# EAGLE design design1 (EAGLE 9.5.1)

## Sheet 1 of 3: Rectifier
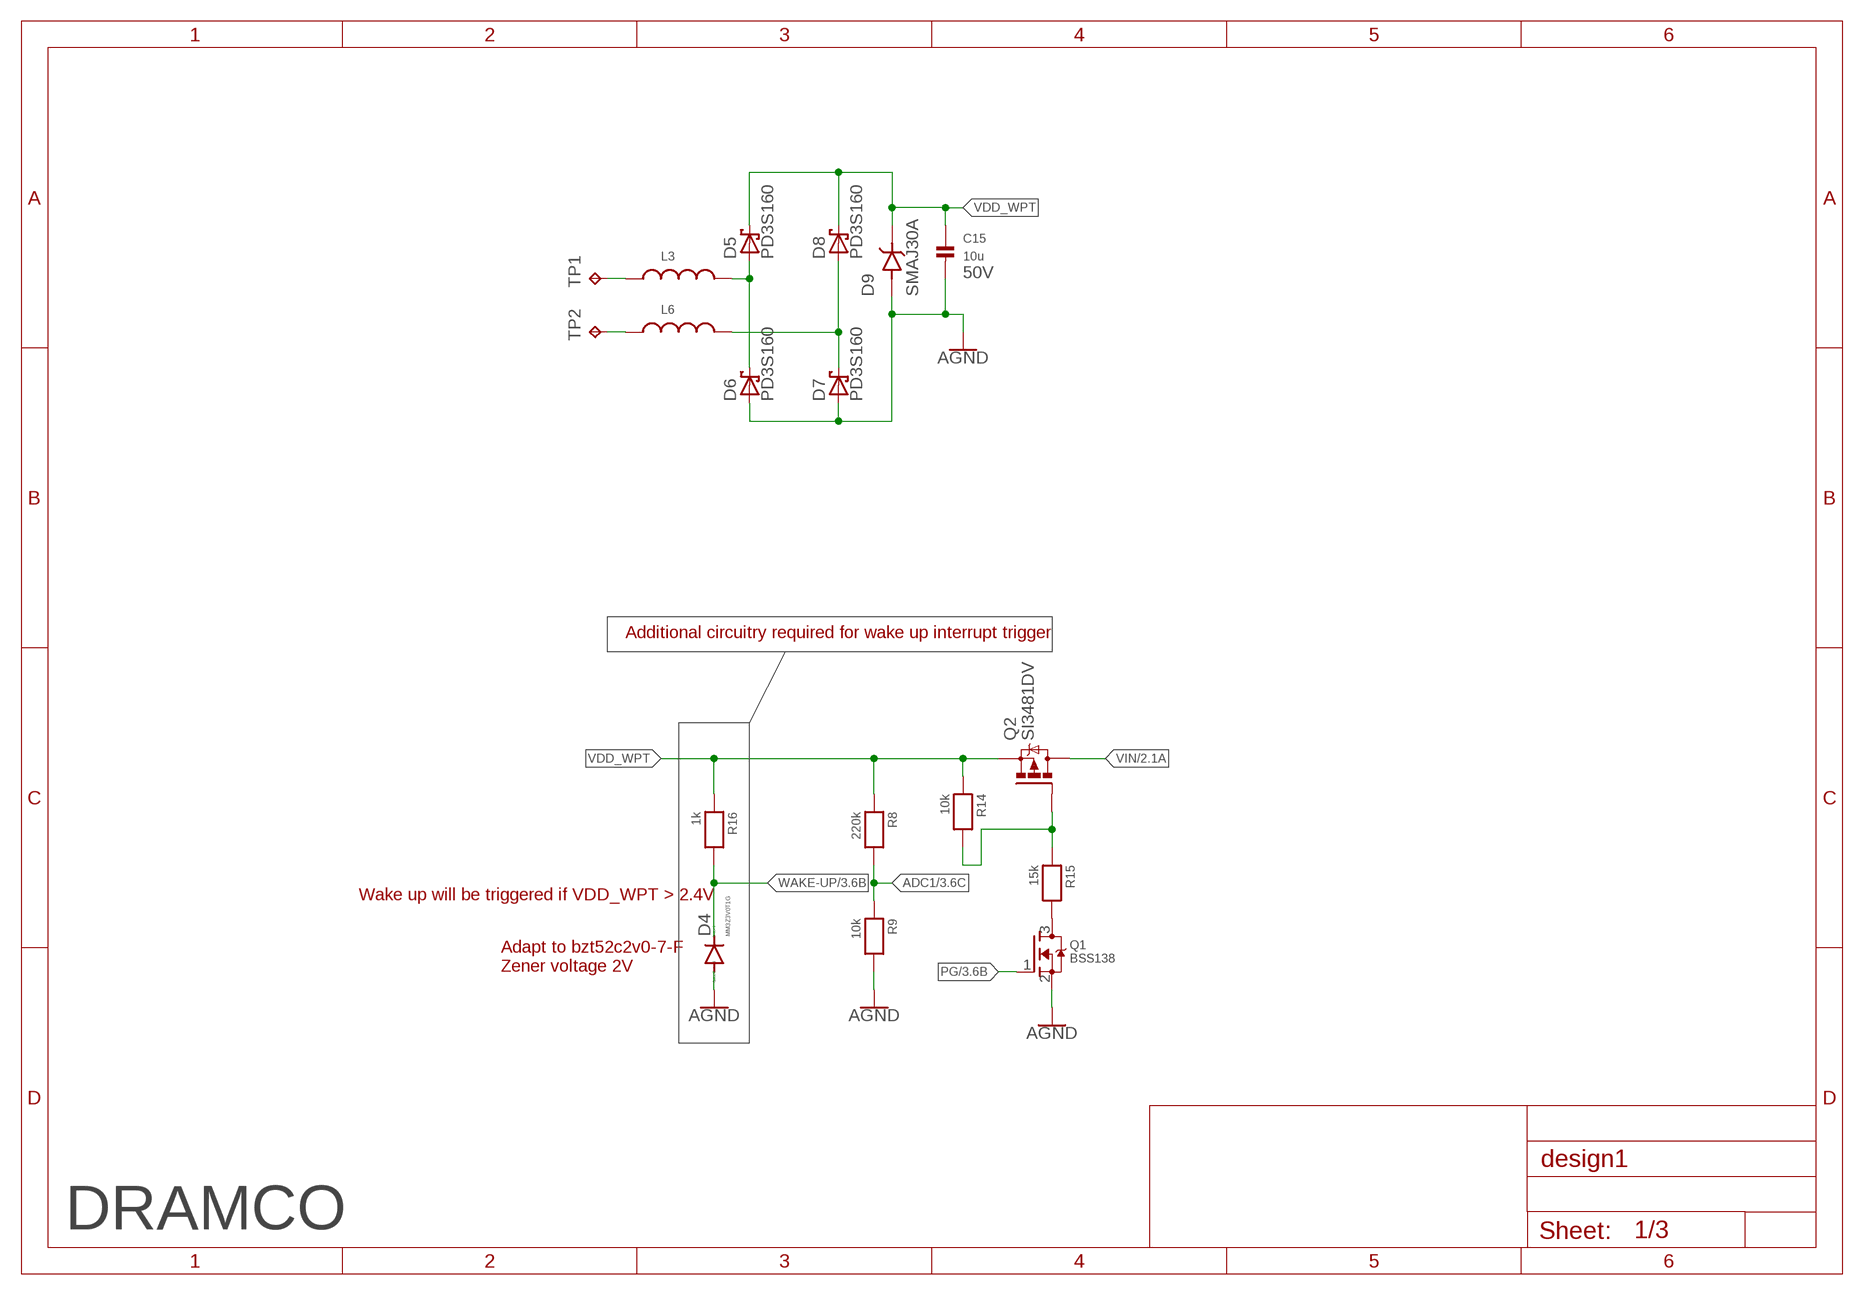
[diagram p0: schematic, sheet 1]

### Parts
C15  10u  CAP_CERAMIC1206  [1206]
D4  MM3Z3V0T1G  DIODE-SOD323-R  [SOD323-R]
D5  PD3S160  [POWERDI323]
D6  PD3S160  [POWERDI323]
D7  PD3S160  [POWERDI323]
D8  PD3S160  [POWERDI323]
D9  SMAJ30A  [DIOM5026X229N]
L3  WE-CAIR_4248_744912182  [WE-CAIR_4248]
L6  WE-CAIR_4248_744912182  [WE-CAIR_4248]
Q1  BSS138  MOSFET-NREFLOW  [SOT23-R]
Q2  SI3481DV  [TSOP-6.PAC]
R8  220k  RESISTOR0603  [0603]
R9  10k  RESISTOR0603  [0603]
R14  10k  RESISTOR0603  [0603]
R15  15k  RESISTOR0603  [0603]
R16  1k  RESISTOR0603  [0603]
TP1  TPTP20SQ  [TP20SQ]
TP2  TPTP20SQ  [TP20SQ]

### Nets
ADC1: R8.2 R9.1 ; also sheet 3
AGND: C15.2 D4.A D6.A D7.A D9.A Q1.2(S) R9.2 ; also sheet 2,3
N$4: Q1.3(D) R15.2
N$5: Q2.3(G) R14.2 R15.1
N$12: L6.1 TP2.TP
N$14: L3.1 TP1.TP
N$15: D5.A D6.C L3.2
N$16: D7.C D8.A L6.2
PG: Q1.1(G) ; also sheet 3
VDD_WPT: C15.1 D5.C D8.C D9.C Q2.4(S) R8.1 R14.1 R16.1
VIN: Q2.1(D) Q2.2(D) Q2.5(D) Q2.6(D) ; also sheet 2
WAKE-UP: D4.C R16.2 ; also sheet 3

### Notes on the sheet
- 50V
- Additional circuitry required for wake up interrupt trigger
- Wake up will be triggered if VDD_WPT > 2.4V
- Adapt to bzt52c2v0-7-F
  Zener voltage 2V
- DRAMCO

## Sheet 2 of 3: Step-down converter
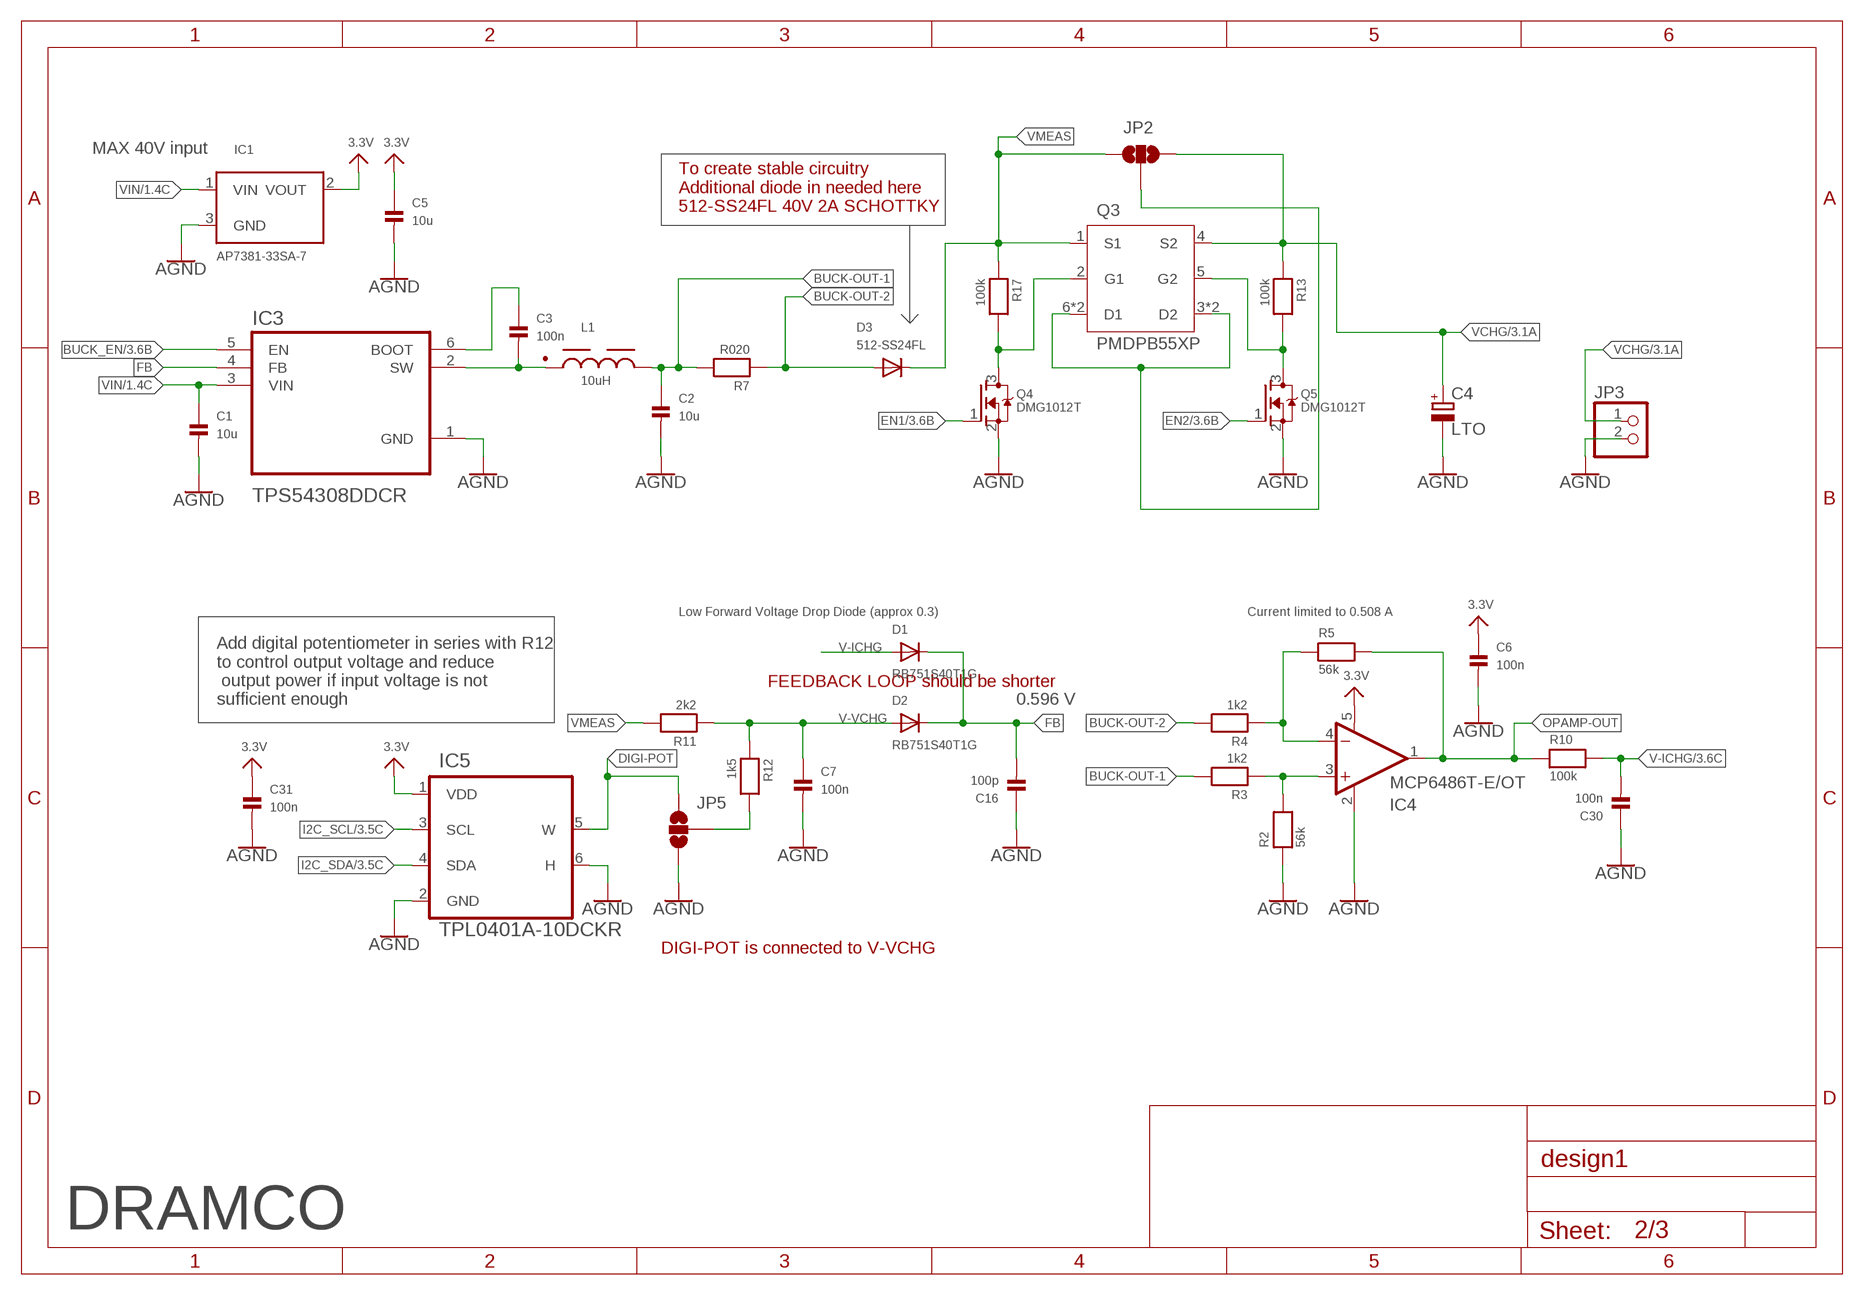
[diagram p1: schematic, sheet 2]

### Parts
C1  10u  CAP_CERAMIC0603  [0603]
C2  10u  CAP_CERAMIC0603  [0603]
C3  100n  CAP_CERAMIC0603  [0603]
C4  LTO  CPOL-EUE5-10.5  [E5-10,5]
C5  10u  CAP_CERAMIC0603  [0603]
C6  100n  CAP_CERAMIC0402  [0402]
C7  100n  CAP_CERAMIC0603  [0603]
C16  100p  CAP_CERAMIC0603  [0603]
C30  100n  CAP_CERAMIC0603  [0603]
C31  100n  CAP_CERAMIC0402  [0402]
D1  RB751S40T1G  DIODESOD-523  [SOD-523]
D2  RB751S40T1G  DIODESOD-523  [SOD-523]
D3  512-SS24FL  DIODESOD-123  [SOD-123]
IC1  AP7381-33SA-7  VREG_SOT23  [SOT23-R]
IC3  TPS54308DDCR  [SOT95P280X110-6N]
IC4  MCP6486T-E/OT  MCP6291T-E/OT  [SOT23-5]
IC5  TPL0401A-10DCKR  [SOT65P210X110-6N]
JP2  JUMPER-SMT_3_NO_NO-SILK  [SMT-JUMPER_3_NO_NO-SILK]
JP3  HEADER-1X2ROUND  [1X02_ROUND]
JP5  JUMPER-SMT_3_NO_NO-SILK  [SMT-JUMPER_3_NO_NO-SILK]
L1  10uH  WE-PD_7332_PLASTIC_7447789127  [WE-PD_7332/7345_PLASTIC_BASE]
Q3  PMDPB55XP  [SON65P200X200X65-8N]
Q4  DMG1012T  [SOT523-3]
Q5  DMG1012T  [SOT523-3]
R2  56k  RESISTOR0603  [0603]
R3  1k2  RESISTOR0603  [0603]
R4  1k2  RESISTOR0603  [0603]
R5  56k  RESISTOR0603  [0603]
R7  R020  RESISTOR0603  [0603]
R10  100k  RESISTOR0603  [0603]
R11  2k2  RESISTOR0603  [0603]
R12  1k5  RESISTOR0603  [0603]
R13  100k  RESISTOR0402  [0402]
R17  100k  RESISTOR0402  [0402]

### Nets
3.3V: C5.1 C6.1 C31.1 IC1.2(VOUT) IC4.5(V+) IC5.1(VDD)
AGND: C1.2 C2.2 C4.- C5.2 C6.2 C7.2 C16.1 C30.1 C31.2 IC1.3(GND) IC3.1(GND) IC4.2(V-) IC5.2(GND) IC5.6(H) JP3.2 JP5.1 Q4.2(S) Q5.2(S) R2.1 ; also sheet 1,3
BUCK-OUT-1: C2.1 L1.2 R3.2 R7.2
BUCK-OUT-2: D3.A R4.2 R7.1
BUCK_EN: IC3.5(EN) ; also sheet 3
DIGI-POT: IC5.5(W) JP5.3
EN1: Q4.1(G) ; also sheet 3
EN2: Q5.1(G) ; also sheet 3
FB: C16.2 D1.K(C) D2.K(C) IC3.4(FB)
I2C_SCL: IC5.3(SCL) ; also sheet 3
I2C_SDA: IC5.4(SDA) ; also sheet 3
N$1: JP2.2 Q3.3(D2) Q3.6(D1) Q3.7(D1) Q3.8(D2)
N$2: C3.1 IC3.6(BOOT)
N$3: C3.2 IC3.2(SW) L1.1
N$6: JP5.2 R12.2
N$8: IC4.4(-IN) R4.1 R5.1
N$9: IC4.3(+IN) R2.2 R3.1
N$17: Q3.2(G1) Q4.3(D) R17.2
N$18: Q3.5(G2) Q5.3(D) R13.2
OPAMP-OUT: IC4.1(OUT) R5.2 R10.1
V-ICHG: C30.2 D1.A R10.2 ; also sheet 3
V-VCHG: C7.1 D2.A R11.1 R12.1
VCHG: C4.+ JP2.3 JP3.1 Q3.4(S2) R13.1 ; also sheet 3
VIN: C1.1 IC1.1(VIN) IC3.3(VIN) ; also sheet 1
VMEAS: D3.C JP2.1 Q3.1(S1) R11.2 R17.1

### Notes on the sheet
- MAX 40V input
- To create stable circuitry
  Additional diode in needed here
  512-SS24FL 40V 2A SCHOTTKY
- Low Forward Voltage Drop Diode (approx 0.3) | Current limited to 0.508 A
- FEEDBACK LOOP should be shorter
- Add digital potentiometer in series with R12 
  to control output voltage and reduce
   output power if input voltage is not 
  sufficient enough
- 0.596 V
- DIGI-POT is connected to V-VCHG
- DRAMCO

## Sheet 3 of 3: MCU
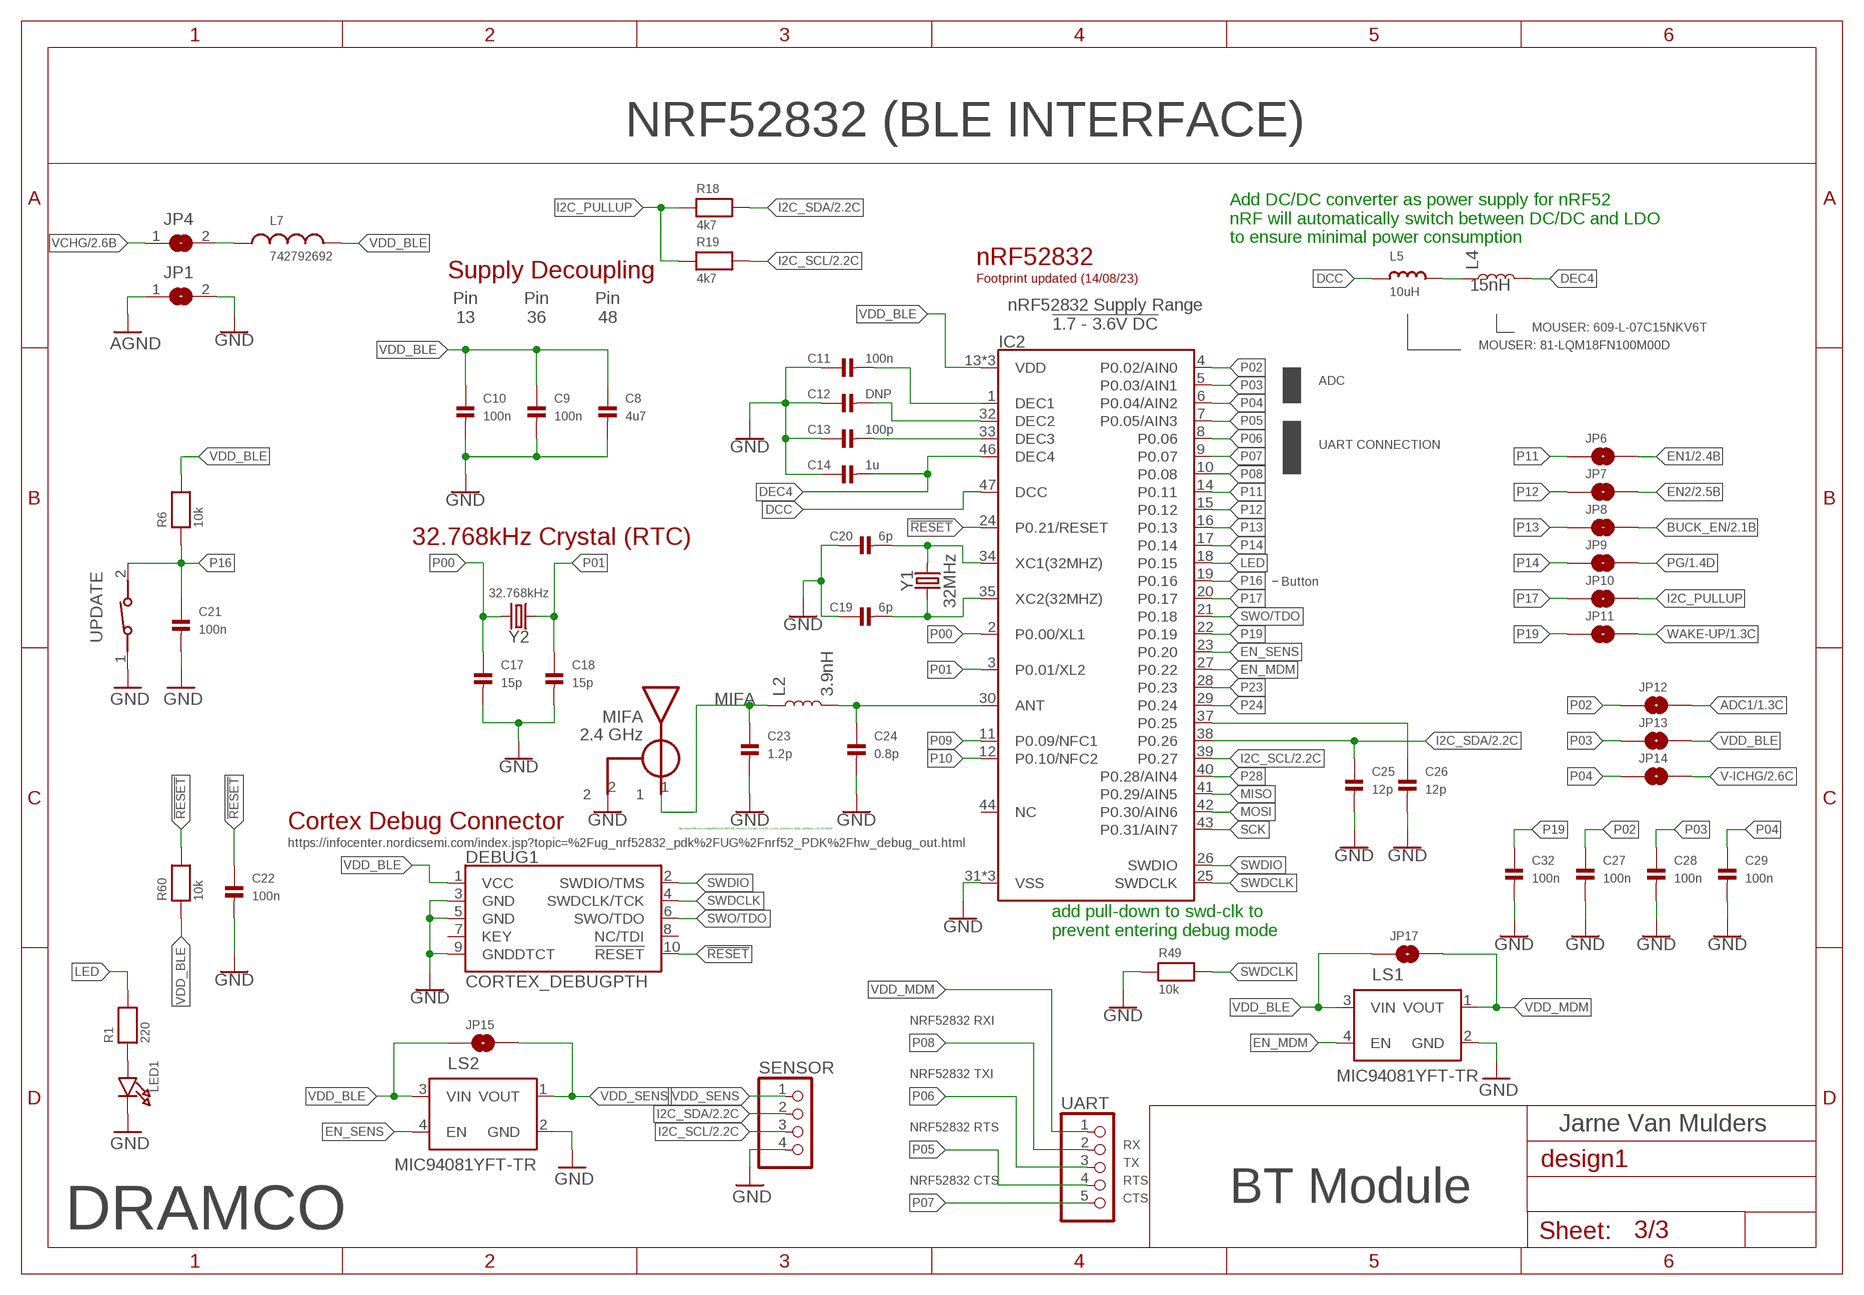
[diagram p2: schematic, sheet 3]

### Parts
C8  4u7  CAP_CERAMIC0603  [0603]
C9  100n  CAP_CERAMIC0402  [0402]
C10  100n  CAP_CERAMIC0402  [0402]
C11  100n  CAP_CERAMIC0402  [0402]
C12  DNP  CAP_CERAMIC0402  [0402]
C13  100p  CAP_CERAMIC0402  [0402]
C14  1u  CAP_CERAMIC0402  [0402]
C17  15p  CAP_CERAMIC0402  [0402]
C18  15p  CAP_CERAMIC0402  [0402]
C19  6p  CAP_CERAMIC0402  [0402]
C20  6p  CAP_CERAMIC0402  [0402]
C21  100n  CAP_CERAMIC0402  [0402]
C22  100n  CAP_CERAMIC0402  [0402]
C23  1.2p  CAP_CERAMIC0402  [0402]
C24  0.8p  CAP_CERAMIC0402  [0402]
C25  12p  CAP_CERAMIC0402  [0402]
C26  12p  CAP_CERAMIC0402  [0402]
C27  100n  CAP_CERAMIC0402  [0402]
C28  100n  CAP_CERAMIC0402  [0402]
C29  100n  CAP_CERAMIC0402  [0402]
C32  100n  CAP_CERAMIC0402  [0402]
DEBUG1  CORTEX_DEBUGPTH  [2X5-PTH-1.27MM]
IC2  NRF52832-EXTENDED  [QFN48-6X6MM-EXTENDED]
JP1  SOLDERJUMPERREFLOW_NOPASTE  [SOLDERJUMPER_REFLOW_NOPASTE]
JP4  SOLDERJUMPERREFLOW_NOPASTE  [SOLDERJUMPER_REFLOW_NOPASTE]
JP6  JUMPER-SMT_2_NO_NO-SILK  [SMT-JUMPER_2_NO_NO-SILK]
JP7  JUMPER-SMT_2_NO_NO-SILK  [SMT-JUMPER_2_NO_NO-SILK]
JP8  JUMPER-SMT_2_NO_NO-SILK  [SMT-JUMPER_2_NO_NO-SILK]
JP9  JUMPER-SMT_2_NO_NO-SILK  [SMT-JUMPER_2_NO_NO-SILK]
JP10  JUMPER-SMT_2_NO_NO-SILK  [SMT-JUMPER_2_NO_NO-SILK]
JP11  JUMPER-SMT_2_NO_NO-SILK  [SMT-JUMPER_2_NO_NO-SILK]
JP12  JUMPER-SMT_2_NO_NO-SILK  [SMT-JUMPER_2_NO_NO-SILK]
JP13  JUMPER-SMT_2_NO_NO-SILK  [SMT-JUMPER_2_NO_NO-SILK]
JP14  JUMPER-SMT_2_NO_NO-SILK  [SMT-JUMPER_2_NO_NO-SILK]
JP15  JUMPER-SMT_2_NO_NO-SILK  [SMT-JUMPER_2_NO_NO-SILK]
JP17  JUMPER-SMT_2_NO_NO-SILK  [SMT-JUMPER_2_NO_NO-SILK]
L2  3.9nH  INDUCTOR-0402-3.9NH  [0402]
L4  15nH  INDUCTOR-0402-3.9NH  [0402]
L5  10uH  INDUCTOR_0603MP  [_0603MP]
L7  742792692  WE-CBF_0603_742792692_WB_HS  [WE-CBF_0603(W=2.2)]
LED1  LED0805  [CHIPLED_0805]
LS1  MIC94081YFT-TR  [IC_MIC94081YFT-TR]
LS2  MIC94081YFT-TR  [IC_MIC94081YFT-TR]
R1  220  RESISTOR0603  [0603]
R6  10k  RESISTOR0402  [0402]
R18  4k7  RESISTOR0402  [0402]
R19  4k7  RESISTOR0402  [0402]
R49  10k  RESISTOR0402  [0402]
R60  10k  RESISTOR0402  [0402]
SENSOR  HEADER-1X4ROUND  [1X04_ROUND]
U$18  BLE-ANT  [ANT-2G4]
UART  HEADER-1X5ROUND  [1X05_ROUND]
UPDATE  434111043826  [434111043826]
Y1  32MHz  CRYSTAL-32MHZ-SMD-2.0X1.6MM  [CRYSTAL-SMD-2.0X1.6MM]
Y2  32.768kHz  CRYSTAL-32.768KHZSMD-3.2X1.5  [CRYSTAL-SMD-3.2X1.5MM]

### Nets
!RESET!: C22.1 DEBUG1.10(!RESET) IC2.24(P0.21/RESET) R60.2
ADC1: JP12.2 ; also sheet 1
AGND: JP1.1 ; also sheet 1,2
ANT: C24.1 IC2.30(ANT) L2.2
BUCK_EN: JP8.2 ; also sheet 2
DCC: IC2.47(DCC) L5.1
DEC4: C14.2 IC2.46(DEC4) L4.2
DEC5: C11.2 IC2.1(DEC1)
DEC6: C12.2 IC2.32(DEC2)
DEC8: C13.2 IC2.33(DEC3)
EN1: JP6.2 ; also sheet 2
EN2: JP7.2 ; also sheet 2
EN_MDM: IC2.27(P0.22) LS1.4(EN)
EN_SENS: IC2.23(P0.20) LS2.4(EN)
GND: C8.2 C9.2 C10.2 C11.1 C12.1 C13.1 C14.1 C17.2 C18.2 C19.1 C20.1 C21.2 C22.2 C23.2 C24.2 C25.2 C26.2 C27.2 C28.2 C29.2 C32.2 DEBUG1.3(GND) DEBUG1.5(GND) DEBUG1.9(GNDDTCT) IC2.31(VSS) IC2.45(VSS) IC2.EP(VSS) JP1.2 LED1.C LS1.2(GND) LS2.2(GND) R49.1 SENSOR.4 U$18.2 UPDATE.1
I2C_PULLUP: JP10.2 R18.1 R19.1
I2C_SCL: IC2.39(P0.27) R19.2 SENSOR.3 ; also sheet 2
I2C_SDA: C25.1 IC2.38(P0.26) R18.2 SENSOR.2 ; also sheet 2
LED: IC2.18(P0.15) R1.2
MIFA: C23.1 L2.1 U$18.1
MISO: IC2.41(P0.29/AIN5)
MOSI: IC2.42(P0.30/AIN6)
N$7: JP4.2 L7.1
N$20: LED1.A R1.1
N$50: C26.1 IC2.37(P0.25)
N$53: L4.1 L5.2
P00: C17.1 IC2.2(P0.00/XL1) Y2.P$2
P01: C18.1 IC2.3(P0.01/XL2) Y2.P$1
P02: C27.1 IC2.4(P0.02/AIN0) JP12.1
P03: C28.1 IC2.5(P0.03/AIN1) JP13.1
P04: C29.1 IC2.6(P0.04/AIN2) JP14.1
P05: IC2.7(P0.05/AIN3) UART.4
P06: IC2.8(P0.06) UART.3
P07: IC2.9(P0.07) UART.5
P08: IC2.10(P0.08) UART.2
P09: IC2.11(P0.09/NFC1)
P10: IC2.12(P0.10/NFC2)
P11: IC2.14(P0.11) JP6.1
P12: IC2.15(P0.12) JP7.1
P13: IC2.16(P0.13) JP8.1
P14: IC2.17(P0.14) JP9.1
P16: C21.1 IC2.19(P0.16) R6.1 UPDATE.2
P17: IC2.20(P0.17) JP10.1
P19: C32.1 IC2.22(P0.19) JP11.1
P23: IC2.28(P0.23)
P24: IC2.29(P0.24)
P28: IC2.40(P0.28/AIN4)
PG: JP9.2 ; also sheet 1
SCK: IC2.43(P0.31/AIN7)
SWDCLK: DEBUG1.4(SWDCLK/TCK) IC2.25(SWDCLK) R49.2
SWDIO: DEBUG1.2(SWDIO/TMS) IC2.26(SWDIO)
SWO/TDO: DEBUG1.6(SWO/TDO) IC2.21(P0.18)
V-ICHG: JP14.2 ; also sheet 2
VCHG: JP4.1 ; also sheet 2
VDD_BLE: C8.1 C9.1 C10.1 DEBUG1.1(VCC) IC2.13(VDD) IC2.36(VDD) IC2.48(VDD) JP13.2 JP15.1 JP17.1 L7.2 LS1.3(VIN) LS2.3(VIN) R6.2 R60.1
VDD_MDM: JP17.2 LS1.1(VOUT) UART.1
VDD_SENS: JP15.2 LS2.1(VOUT) SENSOR.1
WAKE-UP: JP11.2 ; also sheet 1
XC1: C20.2 IC2.34(XC1(32MHZ)) Y1.3
XC2: C19.2 IC2.35(XC2(32MHZ)) Y1.1
Unconnected: DEBUG1.7(KEY) DEBUG1.8(NC/TDI) IC2.44(NC)

### Notes on the sheet
- NRF52832 (BLE INTERFACE)
- Add DC/DC converter as power supply for nRF52
  nRF will automatically switch between DC/DC and LDO
  to ensure minimal power consumption
- nRF52832
- Supply Decoupling
- Footprint updated (14/08/23)
- nRF52832 Supply Range
  !1.7 - 3.6V DC!
- Pin
  13
- Pin
  36
- Pin
  48
- MOUSER: 609-L-07C15NKV6T
- MOUSER: 81-LQM18FN100M00D
- ADC
- UART CONNECTION
- 32.768kHz Crystal (RTC)
- Button
- Cortex Debug Connector | https://www.infineon.com/dgdl/Infineon-AN91445_Antenna_Design_and_RF_Layout_Guidelines-ApplicationNotes-v09_00-EN.pdf
- https://infocenter.nordicsemi.com/index.jsp?topic=%2Fug_nrf52832_pdk%2FUG%2Fnrf52_PDK%2Fhw_debug_out.html
- add pull-down to swd-clk to 
  prevent entering debug mode
- NRF52832 RXI
- NRF52832 TXI
- NRF52832 RTS | Jarne Van Mulders
- RX
- TX
- NRF52832 CTS | RTS
- CTS | BT Module
- DRAMCO

## Library data of the parts
C1-C3 C5-C32 = microbuilder:CAP_CERAMIC: Ceramic Capacitors 0402 - 0402 Surface Mount Capacitors 16pF 50V 5% [Digikey: 445-4899-2-ND] 18pF 50V 5% [Digikey: 490-1281-2-ND] 22pF 50V 5% [Digikey: 490-1283-2-ND] 68pF 50V 5% [Digikey: 490-1289-2-ND] 0.1uF 10V 10% [Digikey: 490-1318-2-ND] 1.0uF 6.3V 10% [Digikey: 490-1320-2-ND] 0603 - 0603 Surface Mount Capacitors 16 pF 50V 5% [Digikey: 445-5051-2-ND] 22 pF 50V [Digikey: PCC220ACVTR-ND] 33 pF 50V 5% [Digikey: 490-1415-1-ND] 56pF 50V 5% [Digikey: 490-1421-1-ND] 220pF 50V 5% [Digikey: 445-1285-1-ND] 680 pF 50V 2200 pF 50V 5% C0G [Digikey: 445-1297-1-ND] 5600 pF 100V 5% X7R [Digikey: 478-3711-1-ND] 0.1 µF 25V 10% [Digikey: PCC2277TR-ND] 0.22 µF 16V 10% X7R [Digikey: 445-1318-1-ND] 1.0 µF 25V 10% [Digikey: 445-5146-2-ND] 0603 - RF Specific 3pF 250V +/-0.1pF RF [Digikey: 712-1347-1-ND] 18 pF 250V 5% [Digikey: 478-3505-1-ND or 712-1322-1-ND] 56 pF 250V 5% C0G RF [Digikey: 490-4867-1-ND] 68 pF 250V RF [Digikey: 490-4868-1-ND] 0805 - 0805 Surface Mount Capacitors 220 pF 250V 2% RF Ceramic Capacitor [Digikey: 712-1398-1-ND] 1000 pF 50V 2% NP0 Ceramic Capacitor [Digikey: 478-3760-1-ND] 0.1 µF 25V 10% Ceramic Capacitor [Digikey: PCC1828TR-ND] 1.0 µF 16V 10% Ceramic Capacitor[Digikey: 490-1691-2-ND] 10.0 µF 10V 10% Ceramic Capacitor[Digikey: 709-1228-1-ND] 10.0 uF 16V 10% Ceramic Capacitor [Digikey: 478-5165-2-ND] 47 uF 6.3V 20% Ceramic Capacitor [Digikey: 587-1779-1-ND or 399-5506-1-ND] 1206 - 1206 Surface Mount Capacitors 47uF 10V 20% Ceramic Capacitor [Digikey: 490-5528-1-ND or 399-5508-1-ND or 445-6010-1-ND] 100uF 6.3V -20%, +80% Y5V Ceramic Capacitor (Digikey: 490-4512-1-ND, Mouser: 81-GRM31CF50J107ZE1L)
C4 = rcl:CPOL-EU: POLARIZED CAPACITOR, European symbol
D1-D3 = microbuilder:DIODE: Diode SMA Model Volts Amps Type Vf Vr Digikey # Notes SSA34-E3 40V 3A Schottky 480mV @ 3A 200uA @ 40V SSA34-E3/61TGITR-ND CDBA120-G 20V 1A Schottky 500mV @ 1A 500uA @ 20V 641-1014-6-ND REEL MBRA210 10V 2A Schottky 350mV @ 2A 700uA @ 10V MBRA210LT3 SOD-123 Model Volts Amps Type Vf Vr Order # Notes BAT54T1G 30V 200mA Schottky 800mV @ 200mA 2uA @ 25V BAT54T1GOSTR-ND B0530W 30V 500mA Schottky 430mV @ 500mA 130uA @ 30V B0530W-FDICT-ND REEL MBR120 1A 20V Schottky 340mV @ 1A MBR120VLSFT1GOSCT-ND SOD-323 Model Volts Amps Type Vf Vr Order # Notes PMEG2005EJ 20V 500mA Schottky 355mV @ 500mA 568-4110-1-ND ZLLS410 10V 570mA Schottky 380mV @ 570mA ZLLS410CT-ND 1N4148WS 75V 150mA Silicon/Simple 1V 1N4148WSFSCT-ND REEL SOD-523 Model Volts Amps Type Vf Vr Order # Notes BAT54XV2 30V 200mA Schottky 0.8V @ 100mA BAT54XV2CT-ND TB751S 30V 30mA Schottky RB751S-40TE61CT-ND SOT23-R/W (R = Solder Paste/Reflow Ovens, W = Hand-Soldering) Model Volts Amps Type Vf Vr Order # Notes BAT54FILM 40V 300mA Schottky 497-7162-1-ND
D4 = diode:DIODE-: DIODE
D5-D8 = diode:PD3S160: 1.0A SURFACE MOUNT SCHOTTKY BARRIER RECTIFIER POWERDI ® 323 Source: http://www.diodes.com/datasheets/ds30899.pdf
D9 = SMAJ30A:SMAJ30A: SMAJ Series 48.4 V 0.4 kW Surface Mount Uni-Directional TVS Diode - DO-214AC Check prices <https://pricing.snapeda.com/parts/SMAJ30A/Littelfuse/view-part?ref=eda>; AVAILABILITY: Good; DESCRIPTION: 48.4V Clamp 8.3A Ipp Tvs Diode Surface Mount DO-214AC (SMA); MF: Littelfuse; MP: SMAJ30A; PACKAGE: DO-214 Littelfuse; PRICE: None; PURCHASE-URL: https://pricing.snapeda.com/search/part/SMAJ30A/?ref=eda
DEBUG1 = SparkFun-Connectors:CORTEX_DEBUG: Cortex Debug Connector Datasheet <http://infocenter.arm.com/help/topic/com.arm.doc.faqs/attached/13634/cortex_debug_connectors.pdf>
IC1 = microbuilder:VREG_SOT23: SOT23 Fixed Voltage Regulators Part Current Out V Out V In V Dropout Digikey Part No. AP7313 150mA 3.3V 3.5-6V 0.15V @ 150mA AP7313-33SAG-7DICT-ND
IC2 = SparkFun-RF:NRF52832-EXTENDED
IC3 = TPS54308DDCR:TPS54308DDCR: Check availability <https://pricing.snapeda.com/parts/TPS54308DDCR/Texas%20Instruments/view-part?ref=eda>; AVAILABILITY: In Stock; DESCRIPTION: 4.5-V to 28-V Input, 3-A output, synchronous 350-kHz FCCM step-down converter; MF: Texas Instruments; MP: TPS54308DDCR; PACKAGE: SOT-23-THN-6 Texas Instruments; PRICE: None; PURCHASE-URL: https://pricing.snapeda.com/search/part/TPS54308DDCR/?ref=eda
IC4 = SparkFun-Retired:MCP6291: Rail to rail OpAmp with 10MHz GBP Prototype: IC-11991; PROD_ID: IC-11991; VALUE: MCP6291T
IC5 = TPL0401A-10DCKR:TPL0401A-10DCKR: Check availability <https://pricing.snapeda.com/parts/TPL0401A-10DCKR/Texas%20Instruments/view-part?ref=eda>; AVAILABILITY: In Stock; CHECK_PRICES: https://www.snapeda.com/parts/TPL0401A-10DCKR/Texas+Instruments/view-part/?ref=eda; DESCRIPTION: 128-tap single-channel digital potentiometer (digipot) with I2C interface (address 0101110); MF: Texas Instruments; MP: TPL0401A-10DCKR; PACKAGE: SOT-SC70-6 Texas Instruments; PRICE: None; PURCHASE-URL: https://pricing.snapeda.com/search?q=TPL0401A-10DCKR&ref=eda; SNAPEDA_LINK: https://www.snapeda.com/parts/TPL0401A-10DCKR/Texas+Instruments/view-part/?ref=snap
JP1 JP4 = microbuilder:SOLDERJUMPER: SMD Solder JUMPER Solder the two pads together to create a connection, or remove the solder to break it. REFLOW - Use this footprint for solder paste and reflow ovens. WAVE - Use this footprint for hand-soldering (larger pads). CLOSED - Has a trace between the two pads to ensure it is closed by default. The trace needs to be cut to disable the jumper, and can be closed again by creating a solder bridge between the two pads.
JP2 JP5 = SparkFun-Jumpers:JUMPER-SMT_3_NO: Normally open jumper This jumper has three pads in close proximity to each other. Apply solder to close the connection(s).
JP3 = microbuilder:HEADER-1X2: PIN HEADER
JP6-JP15 JP17 = SparkFun-Jumpers:JUMPER-SMT_2_NO: Normally open jumper This jumper has two pads in close proximity to each other. Apply solder to close the connection. Round pads are easier to solder for beginners, but are a lot larger. SparkFun Product that uses the round pads: SparkFun EL Sequencer <https://www.sparkfun.com/products/12781>
L1 = EMCComponents (rev19b):WE-PD_7332_PLASTIC: SMD Shielded Power Inductor Characteristics Magnetically shielded version which results in a low leakage field High Saturation currents up to 25 A Very low self-losses at high switching frequency‘s Wide inductances spectrum available at all sizes Operating temperature: –40 °C to +125 °C Applications Perfectly suitable for switching regulators with extremely high efficiency Integrated DC/DC- converter Switching regulators with low operating voltages (Graphic cards, embedded PC-Cards, Mainboards) Plastic base: Because of the one piece construction these are more suitable for high vibration or shock applications <http://katalog.we-online.de/media/images/v2/Family_WE-PD.jpg> Details see: http://katalog.we-online.de/en/pbs/WE-PD? Updated by Dan Xu 2014-07-08 2014 (C) Wurth Elektronik; WE-NUMBER: 7447789127/27uH
L2 = nrf52832-breakout-temp:INDUCTOR: Inductors; PROD_ID: NDUC-13457
L3 L6 = PowerMagnetics (rev18e):WE-CAIR_4248: WE-CAIR Air coil Characteristics Inductance values from 1.65nH up to 120 nH Very high quality factor >100 High self-resonant frequency High currents up to 3.5 A 5%(10%) Inductance tolerance Pick and place process possible Good solderability (Tinned connector pins) Operating temperature: –40 °C to +125 °C Applications Especially for RF application Ideal for high current applications Broad band filter RF-Decoupling <http://katalog.we-online.de/media/images/v2/Family_WE-CAIR_4C.jpg> Details see: http://katalog.we-online.de/en/pbs/WE-CAIR Created on 2014-05-19 2014 (C) Wurth Elektronik; WE-NUMBER: 744912182/82nH
L4 = nrf52832-breakout-temp:INDUCTOR: Inductors; PROD_ID: NDUC-13457; VALUE: 3.9nH
L5 = microbuilder:INDUCTOR: Inductors
L7 = PowerMagnetics (rev18e):WE-CBF_0603: WE-CBF SMD EMI Suppression Ferrite Bead Characteristics Reliable Ni-Sn electrodes High rated current up to 6 A Operating temperature: –55 ºC to +125 ºC Applications Perfect as data lined filter and for uncoupling of distribution voltage Variant abbreviation WB means WIDE BAND HS means HIGH SPEED HC means HIGH CURRENT <http://katalog.we-online.de/media/images/v2/Family_WE-CBF.jpg> Details see: http://katalog.we-online.de/en/pbs/WE-CBF Updated on 2014-06-19 2014 (C) Wurth Elektronik; WE-NUMBER: 742792692/1800Ω(Z@100MHz)
LED1 = microbuilder:LED: LED 0603 - 0603 Surface Mount Package 2mA: Green LED - Low Power (3.9mcd, 2ma, 1.7Vf) - Digikey: 475-2709-2-ND Orange LED - Low Power (9.8mcd, 2ma, 1.8Vf) - Digikey: 475-1194-2-ND Red LED - Low Power (5mcd, 2ma, 1.8Vf) - Digikey: 475-1195-2-ND Yellow LED - Low Power (7mcd, 2ma, 1.8Vf) - Digikey: 475-1196-2-ND 5mA: Blue LED - Low Power (17mcd, 5ma, 2.9Vf) - Digikey: LNJ937W8CRACT-ND 0805 - 0805 Surface Mount Package 2mA: Red LED (8.8mcd, 2mA, 1.8Vf, Clear) - Low Power [Digikey: 475-2510-1-ND] Green LED (5mcd, 2mA, 1.8Vf, Clear) - Low Power [Digikey: 475-2730-1-ND] Yellow LED (11.3mcd, 2mA, 1.8Vf, Clear) - Low Power [Digikey: 475-2555-1-ND] 20mA: Red LED (104mcd, 20mA, Diffused) - LS R976 [Digikey: 475-1278-6-ND] Red LED (12mcd, 20mA, 2.0Vf, Clear) - APT2012EC [Digikey: 754-1128-1-ND] Green LED (15mcd, 20mA, 2.2Vf, Clear) - APT2012GC [Digikey: 754-1131-1-ND] Orange LED (160mcd, 20mA, 2.1Vf, Clear) - APT2012SECK [Digikey: 754-1130-1-ND] 1206 - 1206 Surface Mount Package Green LED (26mcd, 20mA, Diffused) - LG N971 [Digikey: 475-1407-6-ND] Red LED (15mcd, 20mA, Diffused) - LH N974 [Digikey: 475-1416-6-ND]
LS1 LS2 = MIC94081YFT-TR:MIC94081YFT-TR: Power Switch/Driver 1:1 P-Channel 2A 4-TMLF® (0.85x0.85) Check prices <https://pricing.snapeda.com/parts/MIC94081YFT-TR/Microchip/view-part?ref=eda>; AVAILABILITY: In Stock; DESCRIPTION: Power Switch/Driver 1:1 P-Channel 2A 4-TMLF® (0.85x0.85); MF: Microchip; MP: MIC94081YFT-TR; PACKAGE: UFDFN-4 Microchip; PRICE: None
Q1 = microbuilder:MOSFET-N: N-Channel Mosfet LEGEND VDS: Voltage Drain-Source ID: Drain Current RDS(ON): Drain-Source On-State Resistance VGS(TH): Gate-Source Threshold Voltage CISS: Drain-Source Input Capacitance SOT-23 Name VDS ID RDS(ON) VGS(TH) CISS Order Number 2N7002E 60V 260mA 2.5 Ohm 2.5V @ 250uA 26.7pF @ 25V 2N7002ET1GOSTR-ND BSH103 30V 850mA 400 mOhm 400mV @ 1mA 83pF @ 24V BSH103,235-ND BSS138 60V 320mA 1.6 Ohm 1.5V @ 250uA 50pF @ 10V Mouser: 771-BSS138PW115 DMN2075U-7 20V 4.2A 38 mOhm 1V @ 250 uA 594.3pF @ 10V DMN2075U-7DICT-ND * BSS138 good choice for I2C level-shifting
Q2 = transistor-power:SI3481DV: P-Channel 30-V (D-S) MOSFET Source: http://www.vishay.com/docs/72105/72105.pdf
Q3 = PMDPB55XP:PMDPB55XP
Q4 Q5 = microbuilder:DMG1012T
R1-R19 R49 R60 = microbuilder:RESISTOR: Resistors 0402 - 0402 Surface Mount Package 22 Ohm 1% 1/16W [Digikey: 311-22.0LRTR-ND] 33 Ohm 5% 1/16W 1.0K 5% 1/16W 1.5K 5% 1/16W 2.0K 1% 1/16W 10.0K 1% 1/16W [Digikey: 311-10.0KLRTR-ND] 10.0K 5% 1/16W [Digikey: RMCF0402JT10K0TR-ND] 12.1K 1% 1/16W [Digikey: 311-22.0LRTR-ND] 100.0K 5% 1/16W 0603 - 0603 Surface Mount Package 0 Ohm 1/10 Watt 1% Resistor 15 Ohm 1/10 Watt 1% Resistor 33 Ohm 1/10 Watt 1% Resistor 49.9 Ohm 1/10 Watt 1% Resistor 100 Ohm 1/10 Watt 1% Resistor 150 Ohm 1/10 Watt 1% Resistor 240 Ohm 1/10 Watt 1% Resistor 390 Ohm 1/10 Watt 1% Resistor 560 Ohm 1/10 Watt 1% Resistor 680 Ohm 1/10 Watt 1% Resistor 750 Ohm 1/10 Watt 1% Resistor 1.0K Ohm 1/10 Watt 1% Resistor 1.5K Ohm 1/10 Watt 1% Resistor 2.0K Ohm 1/10 Watt 1% Resistor 2.2K Ohm 1/10 Watt 1% Resistor 3.3K Ohm 1/10 Watt 1% Resistor 4.7K Ohm 1/10 Watt 1% Resistor 10.0K Ohm 1/10 Watt 1% Resistor 12.0K Ohm 1/10 Watt 1% Resistor 12.1K Ohm 1/10 Watt 1% Resistor 20.0K Ohm 1/10 Watt 1% Resistor 33.0K Ohm 1/10 Watt 1% Resistor 100.0K Ohm 1/10 Watt 1% Resistor 0805 - 0805 Surface Mount Package 0 Ohm 1/8 Watt 1% Resistor 33 Ohm 1/8 Watt 1% Resistor 100 Ohm 1/8 Watt 1% Resistor 150 Ohm 1/8 Watt 1% Resistor 200 Ohm 1/8 Watt 1% Resistor 240 Ohm 1/8 Watt 1% Resistor 330 Ohm 1/8 Watt 1% Resistor 390 Ohm 1/8 Watt 1% Resistor 470 Ohm 1/8 Watt 1% Resistor 1.0K Ohm 1/8 Watt 1% Resistor 1.5K Ohm 1/8 Watt 1% Resistor 2.0K Ohm 1/8 Watt 1% Resistor 4.7K Ohm 1/8 Watt 1% Resistor 5.1K Ohm 1/8 Watt 1% Resistor 5.6K Ohm 1/8 Watt 1% Resistor 10.0K Ohm 1/8 Watt 1% Resistor 22.0K Ohm 1/8 Watt 1% Resistor 33.0K Ohm 1/8 Watt 1% Resistor 100K Ohm 1/8 Watt 1% Resistor 1206 - 1206 Surface Mount Package 2012 - 2010 Surface Mount Package 0.11 Ohm 1/2 Watt 1% Resistor - Digikey: RHM.11UCT-ND
SENSOR = microbuilder:HEADER-1X4: PIN HEADER
TP1 TP2 = testpad:TP: Test pad
U$18 = ble-antenna:BLE-ANT
UART = microbuilder:HEADER-1X5: PIN HEADER
UPDATE = Eagle_SWITCHES (rev18c):434111043826: 6.0x3.5 mm SMD WS-TASV <http://katalog.we-online.de/media/images/v2/Family_WS-TASV_6.0x3.jpg> Details see: http://katalog.we-online.de/em/datasheet/4341x1xxx8x6.pdf 2015 (C) Wurth Elektronik
Y1 = nrf52832-breakout-temp:CRYSTAL-32MHZ: 32MHz Crystal Digikey Example <http://www.digikey.com/product-detail/en/murata-electronics-north-america/XRCGB32M000F2P00R0/490-9769-1-ND/4952013> Frequency: 32MHz Frequency Stability: ±20ppm Frequency Tolerance: ±20ppm Load Capacitance: 6pF; PROD_ID: XTAL-13459
Y2 = SparkFun-Clocks:CRYSTAL-32.768KHZ: 32.768kHz Crystal Frequency: 32.768kHz Frequency Stability: ±20ppm Load Capacitance: 12.5pF (PTH-2X6 & SMD-3.2X1.5), 6pF (SMD-2X6); PROD_ID: XTAL-13062

## Board
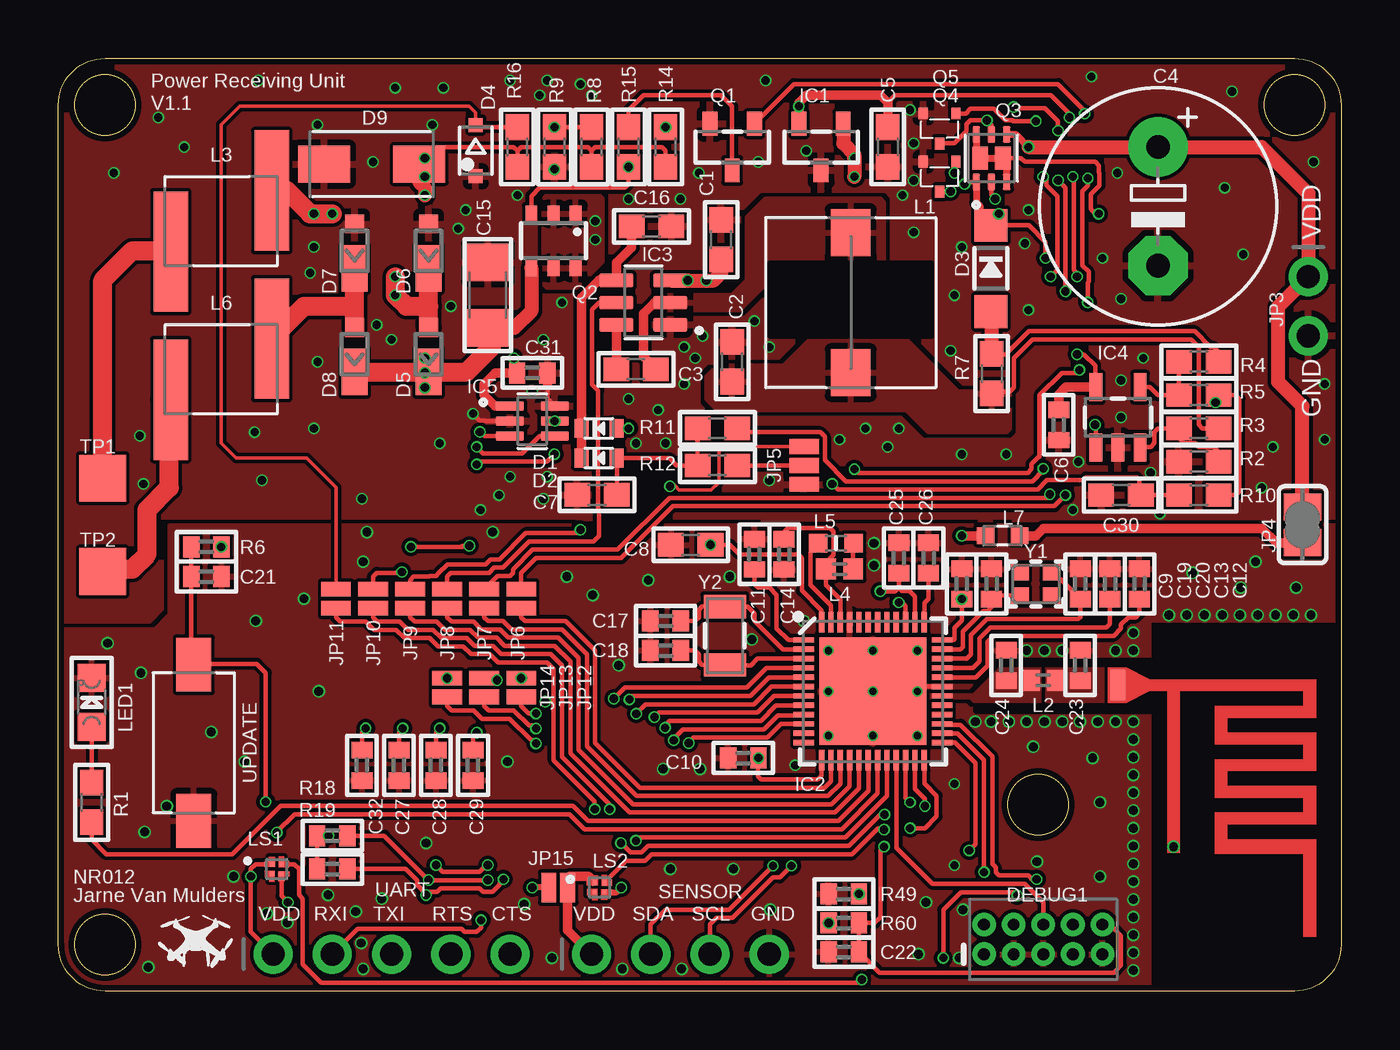
[diagram p3: board, top side]
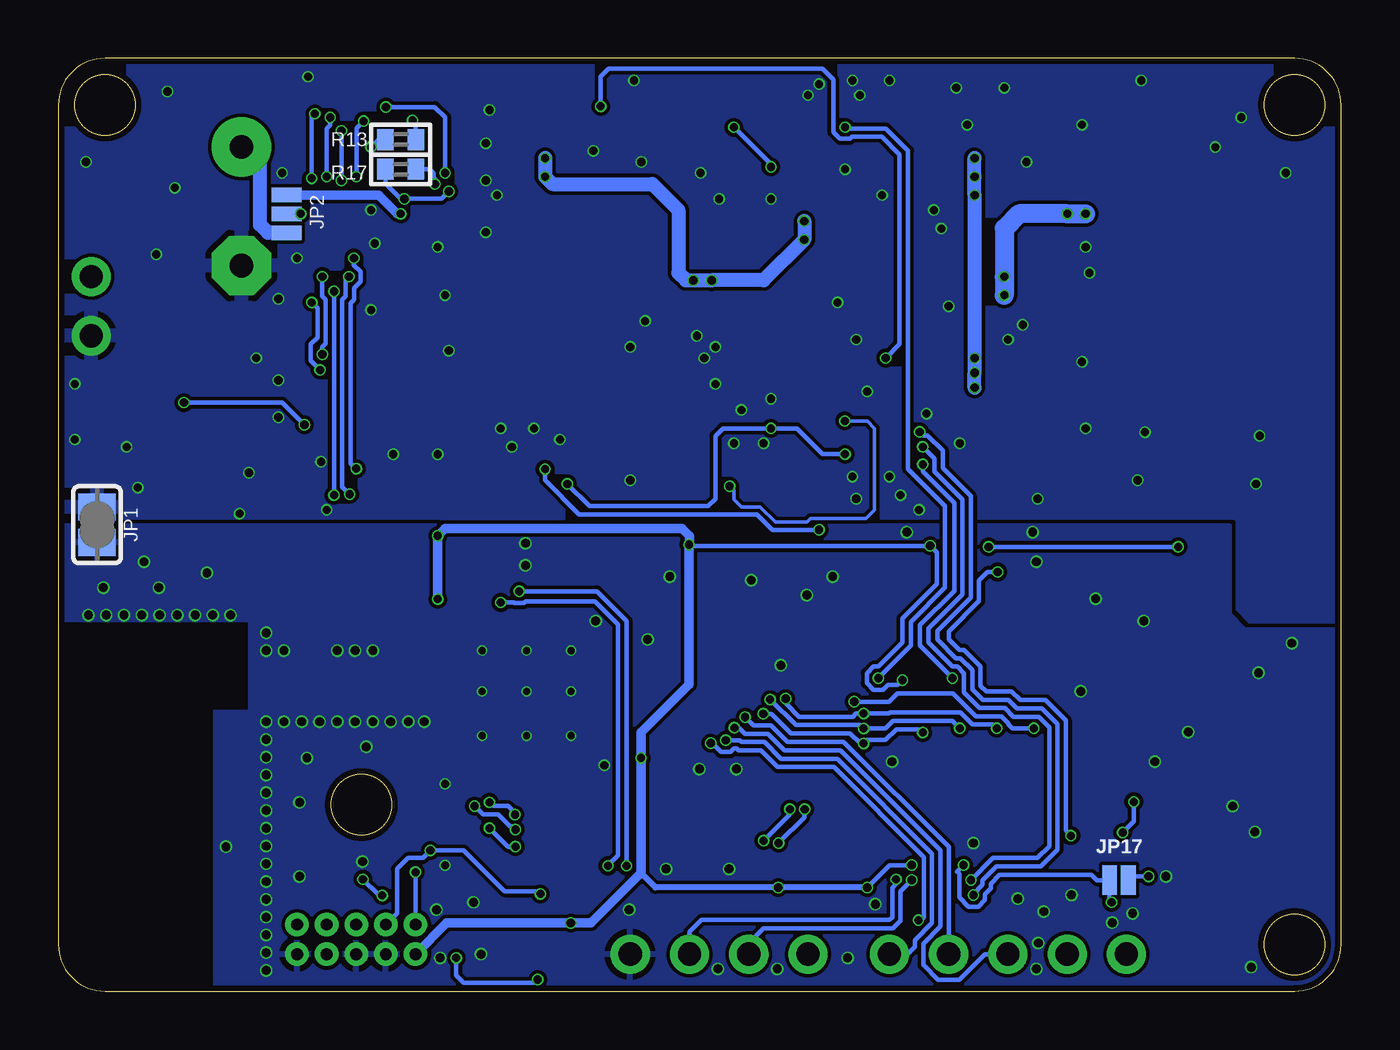
[diagram p4: board, bottom side, seen from below]

Size 55 x 40 mm. Coordinates in mm from the lower left corner, seen from the top.
Outline: 0,2 0,38 arc-90 2,40 53,40 arc-90 55,38 55,2 arc-90 53,0 2,0 arc-90 0,2
Outline: circle at 2,38 radius 1.3
Outline: circle at 2,2 radius 1.3
Outline: circle at 53,38 radius 1.3
Outline: circle at 42,8 radius 1.3
Copper layers (1*16): Top 0.035mm / dielectric 1.5mm / Bottom 0.035mm
Design rules "SeeedStudio_2layer_DRU_no_angle_20140221-2 *": minimum track width 6mil, minimum drill 12mil, track to track 6mil, track to pad 6mil, pad to pad 6mil, via to via 6mil, smd to smd 0mil, copper to edge 10mil, drill to drill 10mil, minimum pad ring 10mil, minimum via ring 2mil, stop-mask expansion 2mil, vias tented up to drill 100mil, thermal gap 10mil
tRestrict: area 39.4,12 to 46.8,12.1; area 40,14.1 to 46.8,14.2

### Footprints (pad centres in the part's own frame; a part is rotated, then mirrored left to right if it is on the bottom)
0603 = smd 1.1 x 1: 1 -0.85,0; 2 0.85,0
E5-10,5 = drill 1.016 pad 2.54: + -2.54,0 | drill 1.016 pad 2.54 octagon: - 2.54,0
0402 = smd 0.7 x 0.9: 1 -0.65,0; 2 0.65,0
1206 = smd 1.6 x 1.8: 1 -1.4,0; 2 1.4,0
SOD-523 = smd 0.8 x 0.6: A 0,-0.75; K 0,0.75
SOD-123 = smd 1.4 x 1.4: A 1.85,0; C -1.85,0
SOD323-R = smd 0.6 x 0.6: A 1.1,0; C -1.1,0
POWERDI323 = smd 0.8 x 0.8: A 1.15,0 | smd 2 x 1.1: C -0.75,0
DIOM5026X229N = smd 2.22 x 1.57: A 2.04,0; C -2.04,0
2X5-PTH-1.27MM = drill 0.508 pad 1: 1 -2.54,-0.635; 2 -2.54,0.635; 3 -1.27,-0.635; 4 -1.27,0.635; 5 0,-0.635; 6 0,0.635; 7 1.27,-0.635; 8 1.27,0.635; 9 2.54,-0.635; 10 2.54,0.635
SOT23-R = smd 0.635 x 1.016: 1 -0.95,-1; 2 0.95,-1; 3 0,1
QFN48-6X6MM-EXTENDED = smd 0.88 x 0.23: 1 -2.96,2.2; 2 -2.96,1.8; 3 -2.96,1.4; 4 -2.96,1; 5 -2.96,0.6; 6 -2.96,0.2; 7 -2.96,-0.2; 8 -2.96,-0.6; 9 -2.96,-1; 10 -2.96,-1.4; 11 -2.96,-1.8; 12 -2.96,-2.2; 25 2.96,-2.2; 26 2.96,-1.8; 27 2.96,-1.4; 28 2.96,-1; 29 2.96,-0.6; 30 2.96,-0.2; 31 2.96,0.2; 32 2.96,0.6; 33 2.96,1; 34 2.96,1.4; 35 2.96,1.8; 36 2.96,2.2 | smd 0.23 x 0.88: 13 -2.2,-2.96; 14 -1.8,-2.96; 15 -1.4,-2.96; 16 -1,-2.96; 17 -0.6,-2.96; 18 -0.2,-2.96; 19 0.2,-2.96; 20 0.6,-2.96; 21 1,-2.96; 22 1.4,-2.96; 23 1.8,-2.96; 24 2.2,-2.96; 37 2.2,2.96; 38 1.8,2.96; 39 1.4,2.96; 40 1,2.96; 41 0.6,2.96; 42 0.2,2.96; 43 -0.2,2.96; 44 -0.6,2.96; 45 -1,2.96; 46 -1.4,2.96; 47 -1.8,2.96; 48 -2.2,2.96 | smd 4.6 x 4.6: EP 0,0
SOT95P280X110-6N = smd 1.45 x 0.59: 1 -1.155,0.95; 2 -1.155,0; 3 -1.155,-0.95; 4 1.155,-0.95; 5 1.155,0; 6 1.155,0.95
SOT23-5 = smd 0.55 x 1.2: 1 -0.95,-1.3; 2 0,-1.3; 3 0.95,-1.3; 4 0.95,1.3; 5 -0.95,1.3
SOT65P210X110-6N = smd 1.19 x 0.4: 1 -0.96,0.65; 2 -0.96,0; 3 -0.96,-0.65; 4 0.96,-0.65; 5 0.96,0; 6 0.96,0.65
SOLDERJUMPER_REFLOW_NOPASTE = smd 1.168 x 1.6: 1 -0.762,0; 2 0.762,0
SMT-JUMPER_3_NO_NO-SILK = smd 0.635 x 1.27: 1 -0.813,0; 2 0,0; 3 0.813,0
1X02_ROUND = drill 1 pad 1.676: 1 -1.27,0; 2 1.27,0
SMT-JUMPER_2_NO_NO-SILK = smd 0.635 x 1.27: 1 -0.406,0; 2 0.406,0
WE-PD_7332/7345_PLASTIC_BASE = smd 2 x 1.7: 1 -3,0; 2 3,0
0402' = smd 0.85 x 0.9: 1 -0.58,0; 2 0.58,0
WE-CAIR_4248 = smd 1.48 x 5.16: 1 -2.165,-1.31; 2 2.165,1.31
_0603MP = smd 0.8 x 0.8: 1 -0.762,0; 2 0.762,0
WE-CBF_0603(W=2.2) = smd 0.75 x 0.7: 1 -0.725,0; 2 0.725,0
CHIPLED_0805 = smd 1.2 x 1.2: A 0,-1.05; C 0,1.05
IC_MIC94081YFT-TR = smd 0.2 x 0.2: 1 -0.2,0.2; 2 -0.2,-0.2; 3 0.2,-0.2; 4 0.2,0.2
TSOP-6.PAC = smd 0.508 x 0.7: 1 -0.95,-1.163; 2 0,-1.163; 3 0.95,-1.163; 4 0.95,1.163; 5 0,1.163; 6 -0.95,1.163
SON65P200X200X65-8N = smd 0.69 x 0.32: 1 -1.02,0.65; 2 -1.02,0; 3 -1.02,-0.65; 4 1.02,-0.65; 5 1.02,0; 6 1.02,0.65 | smd 1 x 0.67: 7 0,0.49; 8 0,-0.49
SOT523-3 = smd 0.4 x 0.51: 1 -0.7,-0.645; 2 0.7,-0.645; 3 0,0.645
1X04_ROUND = drill 1 pad 1.676: 1 -3.81,0; 2 -1.27,0; 3 1.27,0; 4 3.81,0
TP20SQ = smd 2 x 2: TP 0,0
ANT-2G4 = smd 1.27 x 0.635: 1 0.241,-8.496 | smd 0.025 x 0.025: 2 7.417,-5.842
1X05_ROUND = drill 1 pad 1.676: 1 -5.08,0; 2 -2.54,0; 3 0,0; 4 2.54,0; 5 5.08,0
434111043826 = smd 2.3 x 1.5: 1 -3.35,0; 2 3.35,0
CRYSTAL-SMD-2.0X1.6MM = smd 0.75 x 0.7: 1 -0.675,-0.5; 2 0.675,-0.5; 3 0.675,0.5; 4 -0.675,0.5
CRYSTAL-SMD-3.2X1.5MM = smd 1 x 1.8: P$1 -1.25,0; P$2 1.25,0

### Placement (x,y rotation side)
C1  28.42,32.23 90 top
C2  28.89,26.99 90 top
C3  24.77,26.67 0 top
C4  47.15,33.66 270 top
C5  35.56,36.2 270 top
C6  42.89,24.29 270 top
C7  23.1,21.28 180 top
C8  27.11,19.14 180 top
C9  38.73,17.46 90 top
C10  29.37,10 180 top
C11  29.84,18.73 270 top
C12  46.35,17.46 270 top
C13  45.09,17.46 270 top
C14  31.11,18.73 90 top
C15  18.41,29.84 90 top
C16  25.43,32.79 180 top
C17  26.04,15.88 180 top
C18  26.04,14.61 180 top
C19  40.01,17.46 270 top
C20  43.81,17.46 270 top
C21  6.35,17.78 0 top
C22  33.68,1.68 180 top
C23  43.81,13.97 90 top
C24  40.64,13.97 90 top
C25  36.04,18.57 90 top
C26  37.31,18.57 90 top
C27  14.61,9.68 270 top
C28  16.19,9.68 270 top
C29  17.78,9.68 270 top
C30  45.56,21.27 0 top
C31  20.32,26.51 0 top
C32  13.02,9.68 270 top
D1  23.18,24.13 90 top
D2  23.18,22.86 90 top
D3  39.98,30.99 270 top
D4  17.9,36.04 270 top
D5  15.88,27.3 90 top
D6  15.88,31.75 90 top
D7  12.7,31.75 90 top
D8  12.7,27.3 90 top
D9  13.43,35.46 180 top
DEBUG1  42.23,2.22 0 top
IC1  32.7,36.2 180 top
IC2  34.92,12.86 0 top
IC3  25.08,29.53 180 top
IC4  45.43,24.6 0 top
IC5  20.32,24.45 0 top
JP1  53.34,20 270 bottom
JP2  45.21,33.33 270 bottom
JP3  53.59,29.37 270 top
JP4  53.34,20 270 top
JP5  31.98,22.55 90 top
JP6  19.84,16.83 90 top
JP7  18.26,16.83 90 top
JP8  16.67,16.83 90 top
JP9  15.08,16.83 90 top
JP10  13.49,16.83 90 top
JP11  11.91,16.83 90 top
JP12  19.84,13.02 90 top
JP13  18.26,13.02 90 top
JP14  16.67,13.02 90 top
JP15  21.43,4.45 0 top
JP17  9.53,4.76 0 bottom
L1  33.97,29.53 270 top
L2  3.9nH  [0402']  42.23,13.34 180 top
L3  6.99,33.02 0 top
L4  15nH  [0402']  33.5,18.1 180 top
L5  33.34,19.21 0 top
L6  6.99,26.67 0 top
L7  40.48,19.53 180 top
LED1  1.43,12.38 0 top
LS1  9.37,5.24 0 top
LS2  23.2,4.45 0 top
Q1  28.89,36.2 180 top
Q2  21.23,32.17 180 top
Q3  40.01,35.72 90 top
Q4  37.78,34.92 180 top
Q5  37.78,36.99 180 top
R1  1.43,8.1 270 top
R2  48.9,22.7 0 top
R3  48.9,24.13 0 top
R4  48.9,26.99 0 top
R5  48.9,25.56 0 top
R6  6.35,19.05 0 top
R7  40.02,26.48 270 top
R8  22.86,36.2 90 top
R9  21.27,36.2 270 top
R10  48.9,21.27 180 top
R11  28.26,24.13 0 top
R12  28.26,22.54 0 top
R13  40.32,36.51 0 bottom
R14  26.04,36.2 90 top
R15  24.45,36.2 90 top
R16  19.68,36.2 90 top
R17  40.32,35.24 180 bottom
R18  11.75,6.67 0 top
R19  11.75,5.24 0 top
R49  33.68,4.17 0 top
R60  33.68,2.92 0 top
SENSOR  26.67,1.59 0 top
TP1  1.91,22 0 top
TP2  1.91,18 0 top
U$18  53.91,13.37 270 top
UART  14.29,1.59 0 top
UPDATE  5.81,10.65 90 top
Y1  41.91,17.46 0 top
Y2  28.57,15.24 90 top

### Tracks (layer width: path | path; a pad name or v marks a point on that pad's centre or on a via)
3.3V  (via drill 0.35)
  Top 0.203: IC4.5 44.45,25.93 44.45,26.83 43.97,27.3 v43.68,27.3 | v43.68,30.64 43.68,30.77 43.54,30.92 43.54,34.89 v43.5,34.92 | v43.35,37.47 43.35,37.62 42.55,38.42 35.88,38.42 35.56,38.1 | C31.1 19.67,27 v19.53,27.15
  Top 0.406: C5.1 35.56,38.1 35.24,38.42 32.07,38.42 31.75,38.1 v31.75,37.94 IC1.2 | C6.1 42.89,25.58 43.21,25.9 IC4.5 | C31.1 18.73,26.51 18.26,26.04 18.26,25.56 18.72,25.1 IC5.1
  Bottom 0.203: v43.68,27.3 43.68,27.62 43.54,27.77 43.54,29.65 43.68,29.8 v43.68,30.64 | v43.5,34.92 43.5,36.99 43.35,37.14 v43.35,37.47 | v19.53,27.15 18.93,27.74 18.93,35.88 19.68,36.63 20.98,36.63 21.07,36.55 21.48,36.55 21.77,36.84 21.77,39.08 22.25,39.55 31.41,39.55 31.75,39.21 v31.75,37.94
!RESET!  (via drill 0.35)
  Top 0.203: v36.51,6.99 37.15,6.99 37.65,7.49 37.65,8.38 37.12,8.91 IC2.24 | v35.4,6.19 35.24,6.03 35.24,3.17 34.99,2.92 R60.2 C22.1 35.21,0.79 45.24,0.79 45.56,1.11 45.56,2.38 45.24,2.7 44.93,2.7 DEBUG1.10
  Bottom 0.203: v36.51,6.99 35.72,6.19 v35.4,6.19
ADC1  (via drill 0.35)
  Top 0.203: R9.1 R8.2
  Bottom 0.203: R9.1 21.27,36.99 19.53,36.99 18.57,36.04 18.57,22.38 16.99,20.8 16.99,17.3 18.45,15.84 18.45,14.81 JP12.2
  other vias: 19.84,13.42 21.27,37.05
AGND  (via drill 0.35)
  Top 0.203: IC5.6 20.97,25.41 20.97,26.19 | IC5.2 18.31,24.45 18.28,24.48 18.07,24.48 v17.78,24.77
  Top 0.406: C31.2 20.97,26.19 20.97,26.02
  other vias: 46.51,27.15 45.56,26.19 45.56,24.61 51.59,21.59 43.5,20.64 43.74,22.7 36.67,36.35 36.67,34.77 44.29,39.21 30.48,21.91 34.61,24.13 35.56,23.34 36.04,24.13 33.5,23.65 26.83,27.62 27.62,28.1 27.3,27.15 26.83,26.04 24.45,25.4 25.72,24.92 26.04,23.5 21.59,29.53 20.8,27.94 20.32,25.72 17.46,33.5 19.68,34.13 17.14,32.7 16.83,29.37 16.03,37.15 11.11,37.15 13.49,35.56 4.29,37.47 2.38,35.08 3.49,23.81 3.65,21.75 8.73,21.91 10.95,24.13 13.02,21.11 16.35,23.5 18.89,21.27 13.65,28.57 14.29,27.94 10.95,31.91 10.79,30.8 11.11,26.99 8.41,23.97 50.32,38.58 53.82,35.56 50.01,34.45 50.8,31.59 45.56,29.69 54.29,26.04 52.07,23.34 21.27,35.24 32.07,36.04 30,35.56 27.46,35.08 24.45,33.97 26.67,33.97 36.2,34.13 36.67,32.54 36.51,37.78 29.84,28.73 30.48,27.62 38.26,27.46 38.42,29.84 38.73,31.91 41.59,29.21 54.29,23.65 47.23,20.48 30.32,39.05 22.38,38.89 14.45,38.73 8.57,39.05 41.43,32.07 41.59,33.5 46.83,22.23 22.86,38.42 20.95,39.05 20.64,38.42 19.37,39.05 16.51,38.73 5.4,36.2 20.95,22.07 24.77,23.5 20.8,21.11 19.37,22.07 18.1,20.64 40.64,23.02 38.73,23.02 45.4,35.08 44.77,31.43
  pour Top (rank 3): -6.62,41.04 57.01,41.04 57.01,20.19 5.08,20.32 5.08,16.51 3.81,15.24 -0.64,15.24 -5.59,20.19 -6.62,20.19
  pour Bottom (rank 3): -5.84,46.95 61.84,46.95 61.84,20.19 5.08,20.32 5.08,16.51 4.13,15.56 -0.64,15.56 -5.27,20.19 -5.84,20.19
ANT
  pour Top (no thermals): 37.38,12.76 39.24,12.76 40.35,13.88 42.13,13.88 42.13,12.36 39.26,12.36 39.1,12.51 37.38,12.51
BUCK-OUT-1
  Top 0.203: R7.2 40.23,25.63 40.32,25.72 40.8,25.72 40.96,25.88 40.96,27.15 41.75,27.94 48.58,27.94 48.9,27.62 48.9,24.29 49.05,24.13 R3.2
  pour Top: 28.26,26.83 31.11,26.83 32.23,27.94 36.35,27.94 38.58,25.72 40.64,25.72 40.8,25.56 40.8,24.13 40.64,23.97 37.31,23.97 36.35,24.92 28.26,24.92 27.78,25.4 27.78,26.35
BUCK-OUT-2
  Top 0.203: R4.2 49.74,27.41 49.53,27.62 49.4,27.62 48.73,28.3 41.6,28.3 40.61,27.3 40.04,27.3 R7.1
  Top 0.61: R7.1 40.02,29.1 D3.A
BUCK_EN
  Top 0.203: JP8.2 16.67,17.78 16.83,17.94 18.46,17.94 18.68,18.16 19.06,18.16 20.18,19.29 22.94,19.29 23.18,19.53 23.18,20.64 23.14,20.68 23.14,25.75 22.89,26.01 22.89,29.23 23.18,29.53 IC3.5
DCC
  Top 0.203: L5.1 32.58,19.15 32.24,18.81 32.24,17.43 33.12,16.54 IC2.47
DEC4
  Top 0.203: C14.2 31.11,19.68 31.29,19.86 33.08,19.86 33.23,19.71 33.23,18.7 32.92,18.39 L4.2 32.92,17.41 33.52,16.8 IC2.46
DEC5
  Top 0.203: C11.2 29.84,17.46 30,17.3 30.48,17.3 30.8,16.99 30.8,15.56 31.3,15.06 IC2.1
DEC6
  Top 0.203: C12.2 46.35,16.19 46.2,16.03 45.88,16.03 45.56,15.72 45.56,15.56 45.24,15.24 40.1,15.24 39.84,14.98 39.84,13.99 39.85,13.98 39.85,13.97 39.33,13.46 IC2.32
DEC8
  Top 0.203: C13.2 45.09,15.75 44.93,15.6 39.95,15.6 39.48,15.13 39.48,14.13 39.21,13.86 IC2.33
DIGI-POT  (via drill 0.35)
  Top 0.152: v26.22,21.65 26.45,21.65 26.62,21.48 27.99,21.48 28.33,21.82 28.33,23.14 28.55,23.36 JP5.3
  Bottom 0.152: v26.22,21.65 26.04,21.46 26.04,21.09 25.72,20.77 24.91,20.77 24.25,20.11 22.91,20.11 22.76,20.26 20.38,20.26 20,20.64 20,24.13 20.32,24.45 IC5.5
  other vias: 21.28,24.45
EN1  (via drill 0.35)
  Top 0.203: JP6.2 19.84,17.94 20.48,18.57 24.13,18.57 26.35,20.8 42.7,20.8 v43.18,21.27 | v42.86,36.9 42.86,37.31 42.3,37.87 41,37.87 v40.96,37.91 | Q4.1 38.48,35.15 v38.42,35.08 | v42.86,34.77 43.18,34.45 v43.18,30
  Bottom 0.203: v42.86,36.9 v42.86,34.77 | v43.18,21.27 v43.18,30 | v40.96,37.91 38.86,37.91 38.42,37.47 v38.42,35.08
EN2  (via drill 0.35)
  Top 0.203: JP7.2 18.83,17.8 19.37,17.8 19.49,17.93 19.49,18.09 20.33,18.93 23.98,18.93 26.2,21.15 42.42,21.15 42.55,21.27 v42.51,21.31 | v42.55,30.64 42.82,30.92 42.82,34.1 42.36,34.56 42.36,34.78 v42.22,34.92 | Q5.1 38.91,37.63 39.11,37.84 40.11,37.84 40.61,37.34 40.9,37.34 40.93,37.31 v41.91,37.31
  Bottom 0.203: v42.51,21.31 42.82,21.62 42.82,29.65 42.68,29.8 42.68,30.5 v42.55,30.64 | v42.22,34.92 42.22,37 v41.91,37.31
EN_MDM  (via drill 0.35)
  Top 0.203: LS1.4 10.12,5.44 10.32,5.24 10.32,4.13 10.48,3.97 10.48,1.15 11.27,0.36 34.33,0.36 34.45,0.48 v34.45,0.5 | IC2.27 37.92,11.43 38.69,11.43 40.04,10.07 40.04,5.45 40.19,5.31 40.19,5.09 40.32,4.96 41.58,4.96 41.78,4.76 41.91,4.76 v41.95,4.8 | v41.12,4.11 40.97,4.25 38.7,4.25 37.94,3.49 v37.94,1.43
  Bottom 0.203: v41.95,4.8 41.27,4.13 41.12,4.13 v41.12,4.11 | v37.94,1.43 37.94,0.67 37.62,0.36 34.59,0.36 v34.45,0.5
EN_SENS  (via drill 0.35)
  Top 0.203: LS2.4 24.35,5.59 25.15,5.59 25.43,5.87 34.03,5.87 35.14,6.99 35.4,6.99 v35.4,6.93 | v37.16,7.94 37.16,8.25 36.73,8.68 IC2.23
  Bottom 0.203: v35.4,6.93 35.55,7.07 35.63,7.07 36.14,7.58 36.79,7.58 v37.15,7.94 v37.16,7.94
FB
  Top 0.406: D2.K D1.K 22.43,29.73 23.18,30.48 IC3.4 23.93,31.23 24.58,31.88 C16.2
GND  (via drill 0.31, 0.35, 0.38)
  Top 0.025: v47.83,6.2 U$18.2
  Top 0.152: v47.82,6.2 v47.83,6.2
  Top 0.203: IC2.31 37.03,13.06 v36.83,12.86
  other vias: 46.09,11.56 45.33,11.56 46.09,10.79 46.09,10.03 46.09,9.27 46.09,8.51 46.09,7.75 46.09,6.99 46.09,6.22 46.09,5.46 46.09,4.7 46.09,3.94 46.09,3.17 46.09,14.61 45.33,14.61 46.09,15.37 44.56,11.56 43.8,11.56 43.04,11.56 42.28,11.56 41.52,11.56 40.75,11.56 42.28,14.61 43.04,14.61 41.52,14.61 33.02,14.61 36.83,14.61 33.02,12.86 33.02,10.95 34.92,10.95 36.83,10.95 47.61,16.13 48.37,16.13 49.14,16.13 49.9,16.13 50.66,16.13 51.42,16.13 52.18,16.13 52.95,16.13 53.71,16.13 46.09,2.41 46.09,1.65 46.09,0.89 38.42,8.89 38.42,5.4 34.98,19.21 34.98,18.26 31.96,15.88 28.78,17.78 29.74,15.08 25.93,9.53 27.51,9.53 28.94,5.24 26.24,5.24 30.53,3.49 26.72,0.95 24.18,0.95 21.16,1.43 36.88,1.59 38.79,3.49 41.96,5.56 41.8,10.48 44.66,8.1 44.34,10 44.66,4.92 48.63,17.94 50.69,17.3 51.33,18.41 53.07,17.3 39.99,11.56 39.31,11.56 24.02,13.97 22.91,16.99 25.29,17.62 21.8,17.78 11.16,12.86 10.53,16.83 8.46,15.88 6.56,11.11 3.54,13.65 2.11,14.92 3.7,6.83 4.65,7.94 7.99,9.84 7.51,4.92 34.92,12.86 34.92,14.61 13.23,19.68 13.07,18.41 31.59,9.68 13.86,3.97 15.77,6.35 19.26,9.84 18.62,19.68 37.2,3.81 38.63,1.43 8.94,3.33 3.86,1.03 9.81,2.94 11.56,4.13 12.75,3.41 12.99,2.06 13.07,0.95 19.97,3.73
  pour Bottom: 48.3,-3.8 48.3,12.03 46.79,12.03 46.79,15.88 56.2,15.88 56.2,20 4.76,20 4.76,16.19 4.13,15.56 -0.64,15.56 -5.08,20 -6.67,20 -6.67,-3.8
  pour Top (isolate 0.076, rank 2): 46.8,15.86 46.8,-4.76 -0.64,-4.76 -0.64,15.56 4.13,15.56 4.76,16.19 4.76,20 55.33,20 55.33,15.86
I2C_PULLUP  (via drill 0.35)
  Top 0.203: R19.1 R18.1 v11.59,6.67 | JP10.2 13.49,17.78 13.65,17.94 14.76,17.94 v14.73,17.97
  Bottom 0.203: v14.73,17.97 15.17,17.97 15.53,17.62 15.53,16.73 16.82,15.43 16.82,15.09 16.37,14.63 16.17,14.63 15.46,13.93 15.46,13.1 15.21,12.85 14.13,12.85 13.76,12.48 12.68,12.48 11.81,11.61 11.81,6.89 v11.59,6.67
I2C_SCL  (via drill 0.35)
  Top 0.203: v36.04,16.67 36.17,16.67 36.33,16.51 IC2.39 | v31.43,5.38 30.93,4.88 30.64,4.88 28.9,3.14 28.22,3.14 27.94,2.86 SENSOR.3 | IC5.3 18.27,23.8 18.09,23.98 v18.07,23.98 | v19.09,4.8 18.91,4.63 18.91,4.56 18.62,4.26 18.21,4.26 18.07,4.41 16.38,4.41 16.24,4.26 15.91,4.26 v15.77,4.12 15.77,4.16 15.38,4.56 15.38,4.76 14.9,5.24 R19.2
  Bottom 0.203: v36.04,16.67 35.47,16.67 35.45,16.65 35.04,16.65 34.97,16.71 31.98,16.71 30.99,15.73 30.99,5.84 31.43,5.4 v31.43,5.38 | v18.07,23.98 17.93,23.84 17.73,23.84 17.08,23.19 17.08,22.43 15.88,21.23 15.88,16.87 17.31,15.44 17.31,15.07 16.52,14.28 16.32,14.28 15.81,13.78 15.81,12.95 15.36,12.5 14.28,12.5 13.91,12.13 12.82,12.13 12.16,11.47 12.16,6.07 12.87,5.36 14.78,5.36 15.38,4.76 15.38,4.56 15.77,4.16 v15.77,4.12 | v19.09,4.8 19.09,4.59 19.25,4.43 19.25,3.17 19.37,3.05 27.43,3.05 27.94,2.54 SENSOR.3
I2C_SDA  (via drill 0.35)
  Top 0.203: C25.1 36.04,17.3 | 36.04,17.3 35.88,17.14 v35.24,17.14 | v30.64,5.38 28.76,3.49 26.04,3.49 25.4,2.86 SENSOR.2 | 36.04,17.3 36.17,17.17 36.49,17.17 36.73,16.93 IC2.38 | IC5.4 20.62,23.8 19.88,23.06 18.22,23.06 v17.94,23.34 | v18.41,4.76 v15.88,4.76 13.97,6.67 R18.2
  Bottom 0.203: v35.24,17.14 31.91,17.14 30.64,15.88 v30.64,5.38 | v17.94,23.34 17.44,22.84 17.44,22.28 16.24,21.08 16.24,17.02 17.7,15.55 17.7,14.96 16.66,13.92 16.46,13.92 16.17,13.63 16.17,12.8 15.51,12.14 14.43,12.14 14.05,11.77 12.97,11.77 12.52,11.32 12.52,6.21 13.02,5.71 14.92,5.71 v15.88,4.76 | v18.41,4.76 18.89,4.29 18.89,3.02 19.21,2.7 24.77,2.7 25.4,2.06 SENSOR.2
LED
  Top 0.203: IC2.18 34.73,8.58 33.44,7.3 22.7,7.3 22.07,7.94 9.53,7.94 7.46,5.87 2.06,5.87 1.43,6.51 R1.2
MIFA
  pour Top (no thermals): 42.33,13.88 45.1,13.88 45.1,12.36 42.33,12.36
N$1  (via drill 0.35)
  Top 0.203: Q3.8 41.28,35.72 41.44,35.56 44.45,35.56 44.61,35.4 44.61,35.09 44.64,35.06 44.64,34.54 44.26,34.16 44.26,33.52 44.45,33.34 v44.61,33.34
  Top 0.305: Q3.6 39.35,35.88 Q3.7 Q3.8 40.66,35.56 Q3.3
  Bottom 0.203: v44.61,33.34 JP2.2
N$2
  Top 0.406: IC3.6 23.93,26.68 C3.1
N$3
  Top 0.406: C3.2 25.08,27.2 25.08,29.05 25.56,29.53 IC3.2
  pour Top: 25.56,29.84 28.89,29.84 29.53,30.48 29.53,33.18 30.32,33.97 35.24,33.97 35.4,33.81 35.4,31.27 35.08,30.96 31.11,30.96 30.91,30.91 29.21,29.21 25.56,29.21
N$4
  Top 0.203: R15.2 24.45,37.78 25.08,38.42 28.42,38.42 28.89,37.94 Q1.3
N$5  (via drill 0.35)
  Top 0.203: Q2.3 20.28,34.09 20.64,34.45 24.29,34.45 24.45,34.61 R15.1
  Bottom 0.203: R14.2 24.45,35.46 R15.1
  other vias: 24.45,35.34 26.04,37.05
N$6
  Top 0.203: R12.2 JP5.2
N$7
  Top 0.406: L7.1 41.91,19.53 42.23,19.84 51.59,19.84 52.23,19.21 53.31,19.21 JP4.2
N$8
  Top 0.203: R4.1 R5.1 47.15,25.56 46.8,25.9 IC4.4
N$9
  Top 0.203: IC4.3 46.41,23.34 46.83,23.34 46.99,23.5 46.99,23.97 47.15,24.13 R3.1 48.1,24.07 48.1,23.65 48.26,23.5 48.74,23.5 48.9,23.34 49.53,23.34 49.74,23.12 R2.2
N$12
  Top 0.61: TP2.TP 2,18.1
  Top 0.813: L6.1 4.49,25.36 4.76,25.08 4.76,21.59 3.81,20.64 3.81,18.73 3.17,18.1 2,18.1
N$14
  Top 0.813: TP1.TP 1.91,30.48 3.17,31.75 4.78,31.75 L3.1
N$15  (via drill 0.35)
  Top 0.813: D5.A 15.88,29.37 | 15.88,29.37 D6.C | 15.88,29.37 14.92,29.37 v14.45,29.84 v14.45,30.64 | L3.2 9.8,34.33 10.79,33.34 v10.95,33.34 v11.74,33.34
  Bottom 0.813: v14.45,29.84 v14.45,30.64 14.45,32.7 13.81,33.34 v11.75,33.34 v11.74,33.34 v10.95,33.34
N$16
  Top 0.813: D8.A 12.7,29.37 | 12.7,29.37 D7.C | L6.2 10.54,29.37 12.7,29.37
N$17  (via drill 0.35)
  Top 0.203: Q3.2 40.01,34.13 v40.16,33.97 | v38.26,34.29 v38.25,34.28 Q4.3
  Bottom 0.203: v38.26,34.29 38.58,33.97 v40.16,33.97 40.32,33.97 40.97,34.62 R17.2
N$18  (via drill 0.35)
  Top 0.203: Q5.3 37.79,36.35 38.42,36.35 38.94,36.88 38.94,37.17 39.11,37.34 v39.81,37.34 40.01,37.15 Q3.5
  Bottom 0.203: R13.2 39.67,37.2 v39.81,37.34
N$20
  Top 0.203: LED1.A R1.1
N$50
  Top 0.203: C26.1 37.31,16.83 37.12,16.64 IC2.37
N$53
  Top 0.203: L4.1 34.08,19.19 L5.2
OPAMP-OUT  (via drill 0.35)
  Top 0.203: v44.45,24.29 44.48,24.26 IC4.1 | R10.1 50.48,21.27 50.64,21.43 50.64,25.4 50.48,25.56 R5.2 49.74,25.37 v49.61,25.24
  Bottom 0.203: v49.61,25.24 45.4,25.24 v44.45,24.29
P00
  Top 0.203: C17.1 27.3,15.88 27.46,16.03 27.46,16.35 27.6,16.49 Y2.P$2 29.55,16.49 29.84,16.19 29.84,15.88 31.06,14.66 31.07,14.66 IC2.2
P01
  Top 0.203: C18.1 27.3,14.61 27.46,14.45 27.46,14.13 27.6,13.99 Y2.P$1 28.59,13.97 29.69,13.97 29.98,14.26 IC2.3
P02  (via drill 0.35)
  Top 0.203: v23.81,12.54 24.29,13.02 29.53,13.02 30.37,13.86 IC2.4 | v20.48,11.91 20.16,11.91 19.84,12.22 JP12.1 | C27.1 14.61,11.11 v14.76,11.27
  Bottom 0.203: v23.81,12.54 23.81,12.34 23.24,11.76 20.94,11.76 20.8,11.91 v20.48,11.91 19.39,11.91 19.36,11.94 16.32,11.94 15.8,11.43 14.92,11.43 v14.76,11.27
P03  (via drill 0.35)
  Top 0.203: v24.48,12.51 24.45,12.54 24.57,12.66 29.68,12.66 30.47,13.46 IC2.5 | v20.48,11.26 20.35,11.39 20.17,11.39 19.52,12.04 18.44,12.04 18.26,12.22 JP13.1 | C28.1 16.19,11.11 v16.35,11.27
  Bottom 0.203: v24.48,12.51 23.38,11.41 20.62,11.41 v20.48,11.26 19.53,11.26 19.21,11.59 16.67,11.59 v16.35,11.27
P04  (via drill 0.35)
  Top 0.203: v24.78,11.89 24.77,11.91 25.16,12.31 29.82,12.31 30.57,13.06 IC2.6 | v20.48,10.62 20.34,10.77 20.27,10.77 19.35,11.68 18.16,11.68 17.8,12.04 16.85,12.04 16.67,12.22 JP14.1 | C29.1 17.78,10.95 17.94,11.11 v17.94,11.09
  Bottom 0.203: v24.78,11.89 24.43,11.89 23.59,11.05 21.05,11.05 20.64,10.64 20.48,10.64 | 20.48,10.64 v20.48,10.62 | 20.48,10.64 20.35,10.77 19.53,10.77 19.06,11.23 18.08,11.23 v17.94,11.09
P05  (via drill 0.35)
  Top 0.203: v25.56,11.75 25.76,11.95 29.97,11.95 30.68,12.66 IC2.7
  Bottom 0.203: v25.56,11.75 25.2,11.39 24.44,11.39 23.74,10.7 21.33,10.7 16.83,6.19 UART.4
P06  (via drill 0.35)
  Top 0.203: v26.01,11.29 26.01,11.41 26.19,11.59 27.15,11.59 27.15,11.6 30.12,11.6 30.78,12.26 IC2.8
  Bottom 0.203: v26.01,11.29 25.81,11.29 25.55,11.04 24.59,11.04 23.87,10.32 21.46,10.32 17.18,6.04 17.18,2.78 17.92,2.04 17.92,1.14 17.28,0.49 16.38,0.49 15.28,1.59 UART.3
P07  (via drill 0.35)
  Top 0.203: v26.39,10.76 26.39,10.83 26.79,11.23 30.26,11.23 30.85,11.83 31.93,11.83 IC2.9
  Bottom 0.203: v26.39,10.76 25.78,10.76 25.7,10.68 24.73,10.68 24.01,9.96 21.61,9.96 17.54,5.9 17.54,2.92 18.27,2.19 18.27,1.91 18.58,1.6 18.59,1.59 UART.5
P08  (via drill 0.35)
  Top 0.203: v27.03,10.64 26.99,10.64 27.23,10.88 30.41,10.88 30.98,11.46 IC2.10 | v18.12,3.04 18.12,2.73 17.94,2.54 17.42,2.54 17.28,2.68 12.84,2.68 UART.2
  Bottom 0.203: v27.03,10.64 26.97,10.64 26.59,10.26 26.18,10.26 26.04,10.4 25.93,10.4 25.85,10.33 24.88,10.33 24.16,9.61 21.75,9.61 17.89,5.75 17.89,3.17 18.05,3.02 18.1,3.02 v18.12,3.04
P11
  Top 0.203: JP6.1 19.84,16.03 20,15.88 21.75,15.88 23.02,14.61 23.02,10.64 24.93,8.72 32.85,8.72 33.12,8.99 IC2.14
P12
  Top 0.203: JP7.1 18.26,16.03 18.41,15.88 19.08,15.88 19.43,15.52 21.59,15.52 22.66,14.45 22.66,10.49 24.78,8.37 33,8.37 33.52,8.89 IC2.15
P13
  Top 0.203: JP8.1 16.67,16.03 16.85,15.85 17.8,15.85 18.14,15.52 18.93,15.52 19.29,15.16 21.43,15.16 22.31,14.29 22.31,10.34 24.64,8.01 33.15,8.01 33.92,8.79 IC2.16
P14
  Top 0.203: JP9.1 15.08,16.03 15.27,15.85 16.22,15.85 16.57,15.49 17.66,15.49 17.99,15.16 18.78,15.16 19.14,14.81 21.27,14.81 21.95,14.13 21.95,10.19 24.49,7.66 33.3,7.66 34.33,8.69 IC2.17
P16  (via drill 0.35)
  Top 0.203: v9.37,6.8 9.37,6.83 10.12,7.58 21.92,7.58 22.55,6.95 33.59,6.95 35.12,8.48 IC2.19 | v8.89,8.12 8.89,13.65 8.51,14.03 5.78,14.03 | R6.1 C21.1 5.7,14.11 5.78,14.03 | UPDATE.2 5.78,14.03
  Bottom 0.203: v9.37,6.8 8.89,7.28 v8.89,8.12
P17  (via drill 0.35)
  Top 0.203: v24.77,6.45 24.77,6.51 24.85,6.59 33.74,6.59 35.52,8.38 IC2.20 | v23.64,7.8 23.64,8 21.6,10.05 21.6,13.97 21.11,14.45 18.99,14.45 18.64,14.81 17.84,14.81 17.51,15.14 16.43,15.14 16.07,15.49 14.99,15.49 14.63,15.85 13.68,15.85 13.49,16.03 JP10.1
  Bottom 0.203: v24.77,6.45 23.65,7.56 23.65,7.79 v23.64,7.8
P19  (via drill 0.35)
  Top 0.203: v35.42,7.57 35.22,7.57 33.89,6.24 25.29,6.24 25,5.95 24.53,5.95 v24.13,6.35 v24.12,6.35 | v23,7.8 23,8.14 21.24,9.9 21.24,12.38 | 21.24,12.38 21.24,13.81 20.95,14.1 18.84,14.1 18.49,14.45 17.69,14.45 17.36,14.78 16.28,14.78 15.92,15.14 14.84,15.14 14.48,15.49 13.53,15.49 13.18,15.85 12.09,15.85 11.91,16.03 JP11.1 | IC2.22 36.33,8.28 v36.51,8.1 | C32.1 13.02,11.11 v13.18,11.27 | v20.88,12.42 21.21,12.42 21.24,12.38
  Bottom 0.203: v36.51,8.1 36.35,7.94 35.72,7.94 35.4,7.62 35.4,7.59 v35.42,7.57 | v24.12,6.35 23.02,7.45 23.02,7.78 v23,7.8 | v13.18,11.27 14.11,11.27 14.27,11.43 14.27,11.48 14.57,11.79 15.66,11.79 16.65,12.78 19.03,12.78 19.4,12.4 20.86,12.4 v20.88,12.42
PG  (via drill 0.35)
  Top 0.203: Q1.1 31.54,38.89 42.86,38.89 43.97,37.78 43.97,37.65 v44,37.62 | v44.14,34.86 44.14,34.54 43.91,34.31 43.91,31.12 44.18,30.84 44.18,30.43 44.13,30.39 v44.13,29.53 | v43.78,26.64 43.66,26.51 43.02,26.51 42.07,25.56 42.07,22.91 42.02,22.91 41.73,22.61 41.73,22.38 41.57,22.23 34.29,22.23 v34.13,22.38 | v22.38,19.78 22.24,19.64 20.04,19.64 18.91,18.52 18.53,18.52 18.31,18.29 16.68,18.29 16.31,17.93 16.19,17.8 15.93,17.8 15.9,17.78 15.24,17.78 15.08,17.62 JP9.2
  Bottom 0.203: v44,37.62 44.13,37.49 v44.13,34.87 v44.14,34.86 | v44.13,29.53 43.89,29.29 43.89,28.02 44.18,27.74 44.18,27.03 v43.78,26.64 | v34.13,22.38 34.13,21.91 32.66,20.44 25.04,20.44 24.39,19.78 v22.38,19.78
SWDCLK  (via drill 0.35)
  Top 0.203: v39.05,6.03 39.32,6.3 39.32,9.79 38.45,10.66 IC2.25
  Bottom 0.203: DEBUG1.4 40.48,3.33 40.48,5.24 40.01,5.71 39.37,5.71 v39.05,6.03 37.62,6.03 35.88,4.29 34.45,4.29 R49.2
  other vias: 34.33,4.17
SWDIO  (via drill 0.35)
  Top 0.203: v39.69,5.1 39.69,9.92 38.55,11.06 IC2.26
  Bottom 0.203: DEBUG1.2 v39.69,5.1
SWO/TDO
  Top 0.203: DEBUG1.6 42.23,3.81 41.43,4.6 37.47,4.6 35.92,6.15 IC2.21
V-ICHG  (via drill 0.35)
  Top 0.203: D1.A v24.45,24.13 | v33.18,21.75 33.42,21.51 41.99,21.51 42.39,21.91 43.94,21.91 44.06,22.03 46.24,22.03 46.35,21.91 46.35,21.33 C30.2 R10.2 | v17.94,22.59 18.05,22.7 20.95,22.7 21.27,23.02 v21.27,23.03
  Bottom 0.203: v33.18,21.75 32.23,20.8 27.15,20.8 26.83,21.11 26.83,23.81 26.51,24.13 v24.45,24.13 23.34,24.13 22.23,23.03 v21.27,23.03 | JP14.2 18.06,14.81 18.06,15.7 16.59,17.17 16.59,20.93 17.94,22.28 v17.94,22.59
  other vias: 16.67,13.42
V-VCHG
  Top 0.203: R11.1 R12.1 26.51,22.54 26.19,22.86 D2.A 23.95,22.84 C7.1
VCHG  (via drill 0.35)
  Top 0.305: Q3.4 41.05,36.74 v41.59,36.2
  Top 0.61: v41.59,36.2 C4.+ 51.59,36.2 53.59,34.2 JP3.1 52.3,29.35 52.3,26.13 53.34,25.08 JP4.1
  Bottom 0.203: R13.1 41.27,36.51 v41.59,36.2
  Bottom 0.61: JP2.3 46.01,32.52 46.35,32.86 46.35,35.4 C4.+
VDD_BLE  (via drill 0.35)
  Top 0.152: R6.2 v6.99,19.05 | v24.13,4.45 v24.14,4.45
  Top 0.203: C9.1 38.73,15.89 38.42,15.57 38.42,15.08 38.4,15.06 IC2.36 | C8.1 28.8,19.14 29.21,18.73 31.72,18.73 31.88,18.57 31.88,17.17 32.73,16.33 IC2.48 | C10.1 30,9.99 30,9.21 30.13,9.08 32.58,9.08 32.73,9.23 IC2.13 | v15.11,19.05 17.3,19.05 17.3,19.1 v17.62,19.1 | JP13.2 18.72,13.42 v18.81,13.34 | LS1.3 9.57,4.09 v9.84,3.81 | v18.41,5.41 18.27,5.26 18.21,5.26 18.07,5.12 16.47,5.12 v16.19,5.4 v16.19,5.41
  Top 0.254: LS2.3 23.93,4.25 v24.13,4.45 | JP15.1 v20.32,4.45
  Top 0.406: L7.2 v38.73,19.53
  Bottom 0.203: v6.99,19.05 v15.11,19.05 | C8.1 27.92,19.14 27.88,19.1 v17.62,19.1 17.34,18.82 17.34,17.45 18.81,15.98 18.81,14.96 19.85,13.92 20.05,13.92 20.34,13.63 20.34,13.22 20.05,12.93 19.64,12.93 19.43,13.13 19.02,13.13 v18.81,13.34 | v9.84,3.81 9.93,3.9 JP17.1 10.48,4.76 10.7,4.99 14.64,4.99 15.02,4.61 15.02,4.41 15.27,4.16 15.27,3.91 15.56,3.62 15.97,3.62 16.37,4.02 16.37,5.03 16.47,5.12 v16.19,5.41 | v20.32,4.45 19.37,5.4 v18.41,5.4 v18.41,5.41
  Bottom 0.254: 30.02,5.07 29.4,4.45 v24.14,4.45 v20.32,4.45
  Bottom 0.406: C9.1 v38.73,19.53 38.42,19.84 28.26,19.84 27.94,19.53 27.94,19.16 C8.1 27.96,13.15 30.02,11.1 C10.1 30.02,5.07 32.16,2.92 R60.1 38.35,2.92 DEBUG1.1
  other vias: 38.73,16.81 27.96,19.14 30.02,10 33.03,2.92
VDD_MDM  (via drill 0.35)
  Top 0.203: LS1.1 8.46,5.44 8.26,5.24 v8.26,4.92 8.26,2.54 UART.1
  Bottom 0.203: JP17.2 8.96,4.92 v8.26,4.92
VDD_SENS
  Top 0.152: 22.93,4.72 LS2.1
  Top 0.406: 22.93,4.72 22.73,4.92 21.91,4.92 21.84,4.85 JP15.2 21.84,2.61 SENSOR.1
VDD_WPT  (via drill 0.35)
  Top 0.203: R8.1 22.86,36.04 | 22.86,36.04 22.7,36.2 19.84,36.2 19.68,36.04 | 19.68,36.04 R16.1 | D9.C 16.21,36.2 19.53,36.2 19.68,36.04 | D5.C 15.83,26.51 v15.72,26.51 | R14.1 26.04,36.04 25.88,36.2 23.02,36.2 22.86,36.04
  Top 0.61: Q2.4 20.28,29.17 19.55,28.45 C15.1 | D9.C 15.47,34.69 15.72,34.45 v15.72,34.13
  Top 0.813: D8.C D5.C 17.51,26.55 18.57,27.62 18.57,28.29 C15.1
  Bottom 0.61: v15.72,25.88 v15.72,26.51 v15.72,27.15 v15.72,34.13 v15.72,34.92 v15.72,35.72
VIN  (via drill 0.35)
  Top 0.61: IC3.3 v26.99,30.48 28.1,30.48 28.42,30.8 C1.1 | IC1.1 33.66,36.35 34.13,35.88 v34.13,35.72 v34.13,34.92
  Bottom 0.61: v26.99,30.48 v27.78,30.48 28.1,30.48 28.42,30.8 28.42,33.5 29.53,34.61 33.81,34.61 v34.13,34.92 v34.13,35.72 | v26.99,30.48 | v23.02,33.02 v23.02,32.23 24.77,30.48 v26.99,30.48
  pour Top: 20.8,33.97 20.8,30.32 20.95,30.16 22.23,30.16 23.34,31.27 23.34,33.97 23.18,34.13 20.95,34.13
VMEAS  (via drill 0.35)
  Top 0.203: R11.2 29.27,23.97 32.67,23.97 32.86,23.78 32.86,22.77 33.77,21.86 41.75,21.86 42.23,22.34 v42.23,22.41 | D3.C 41.62,32.84 42.33,32.13 v42.33,31.43 | v38.85,34.61 38.94,34.7 Q3.1
  Top 0.305: Q3.1 39.35,33.83 39.53,33.66 39.53,33.29 39.9,32.92 D3.C
  Top 0.406: v40.32,33.34 39.9,32.92
  Bottom 0.203: v42.23,22.41 42.25,22.41 42.47,22.62 42.47,29.51 42.33,29.65 42.33,30.15 42.05,30.43 42.05,30.84 42.34,31.14 v42.34,31.42 v42.33,31.43 | R17.1 39.08,35.24 38.92,35.08 38.92,34.88 38.85,34.81 v38.85,34.61
  Bottom 0.406: JP2.1 44.81,34.13 41.27,34.13 40.48,33.34 v40.32,33.34
WAKE-UP
  Top 0.152: JP11.2 11.91,21.59 10.64,22.86 7.62,22.86 6.99,23.5 6.99,37.15 7.78,37.94 17.62,37.94 17.9,37.66 D4.C
  Top 0.203: R16.2 17.99,37.05 D4.C
XC1
  Top 0.203: Y1.3 42.67,17.96 43.21,17.42 43.21,17.41 C20.2 43.81,16.03 43.73,15.95 39.81,15.95 39.13,15.27 39.13,14.45 38.94,14.26 IC2.34
XC2
  Top 0.203: Y1.1 40.16,16.96 C19.2 40.01,16.47 39.85,16.31 39.66,16.31 38.77,15.42 38.77,14.76 38.66,14.66 IC2.35

### Text on the board
tPlace: NR012 | Jarne Van Mulders
tNames: Power Receiving Unit | V1.1 | VDD | GND | VDD | RXI | TXI | RTS | CTS | VDD | SDA | SCL | GND